# EAGLE design STM32F4CONSOLE (EAGLE 6.5.0)
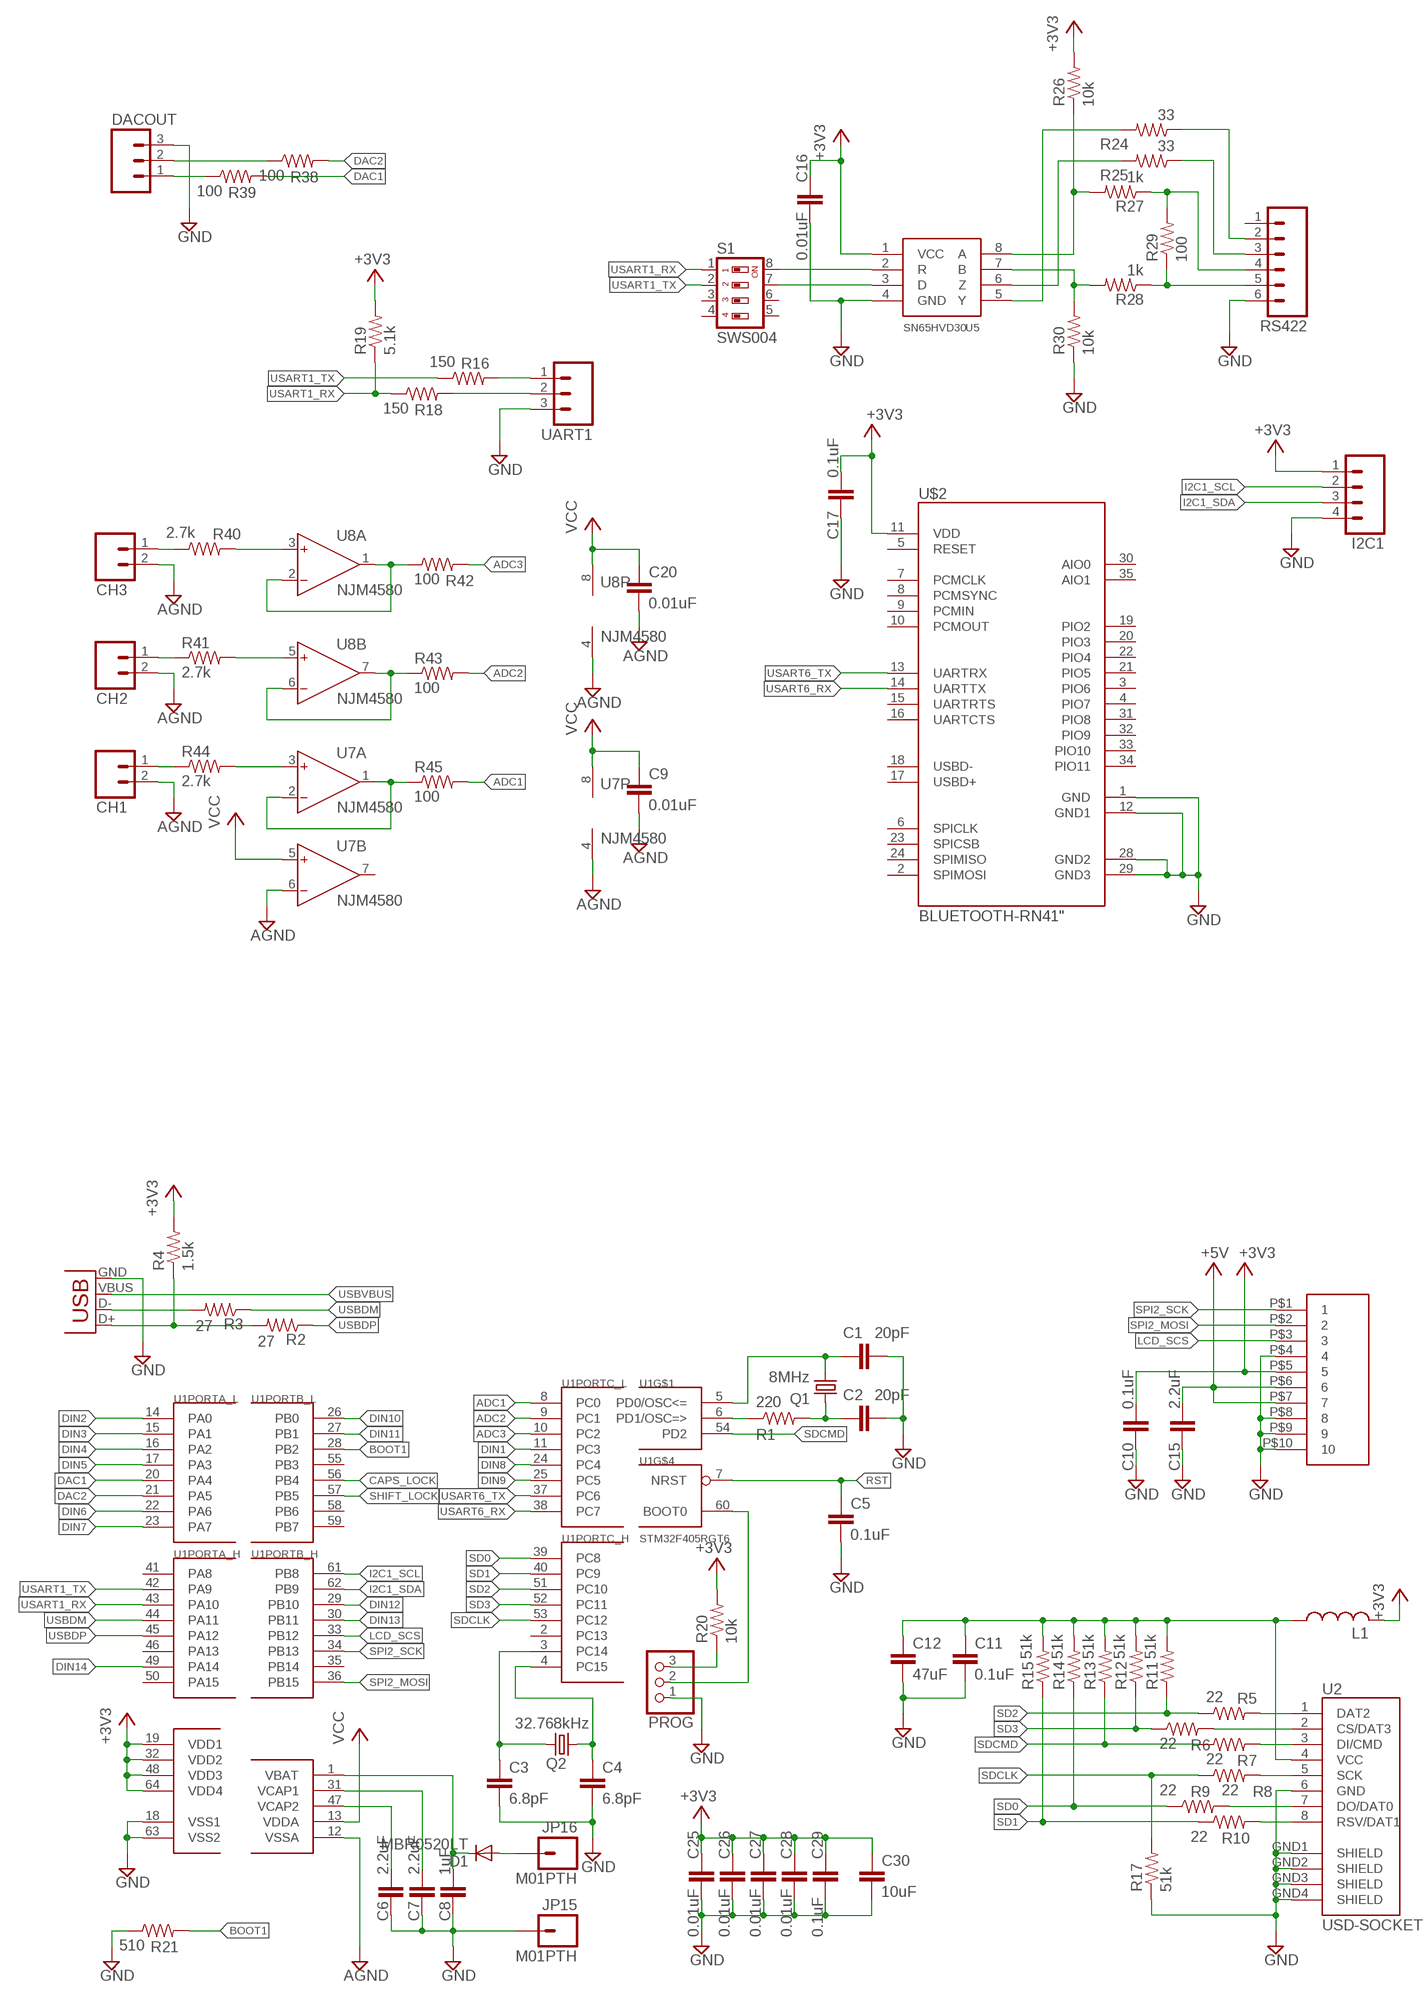
[diagram p0: schematic, sheet 1, part 1 of 2]
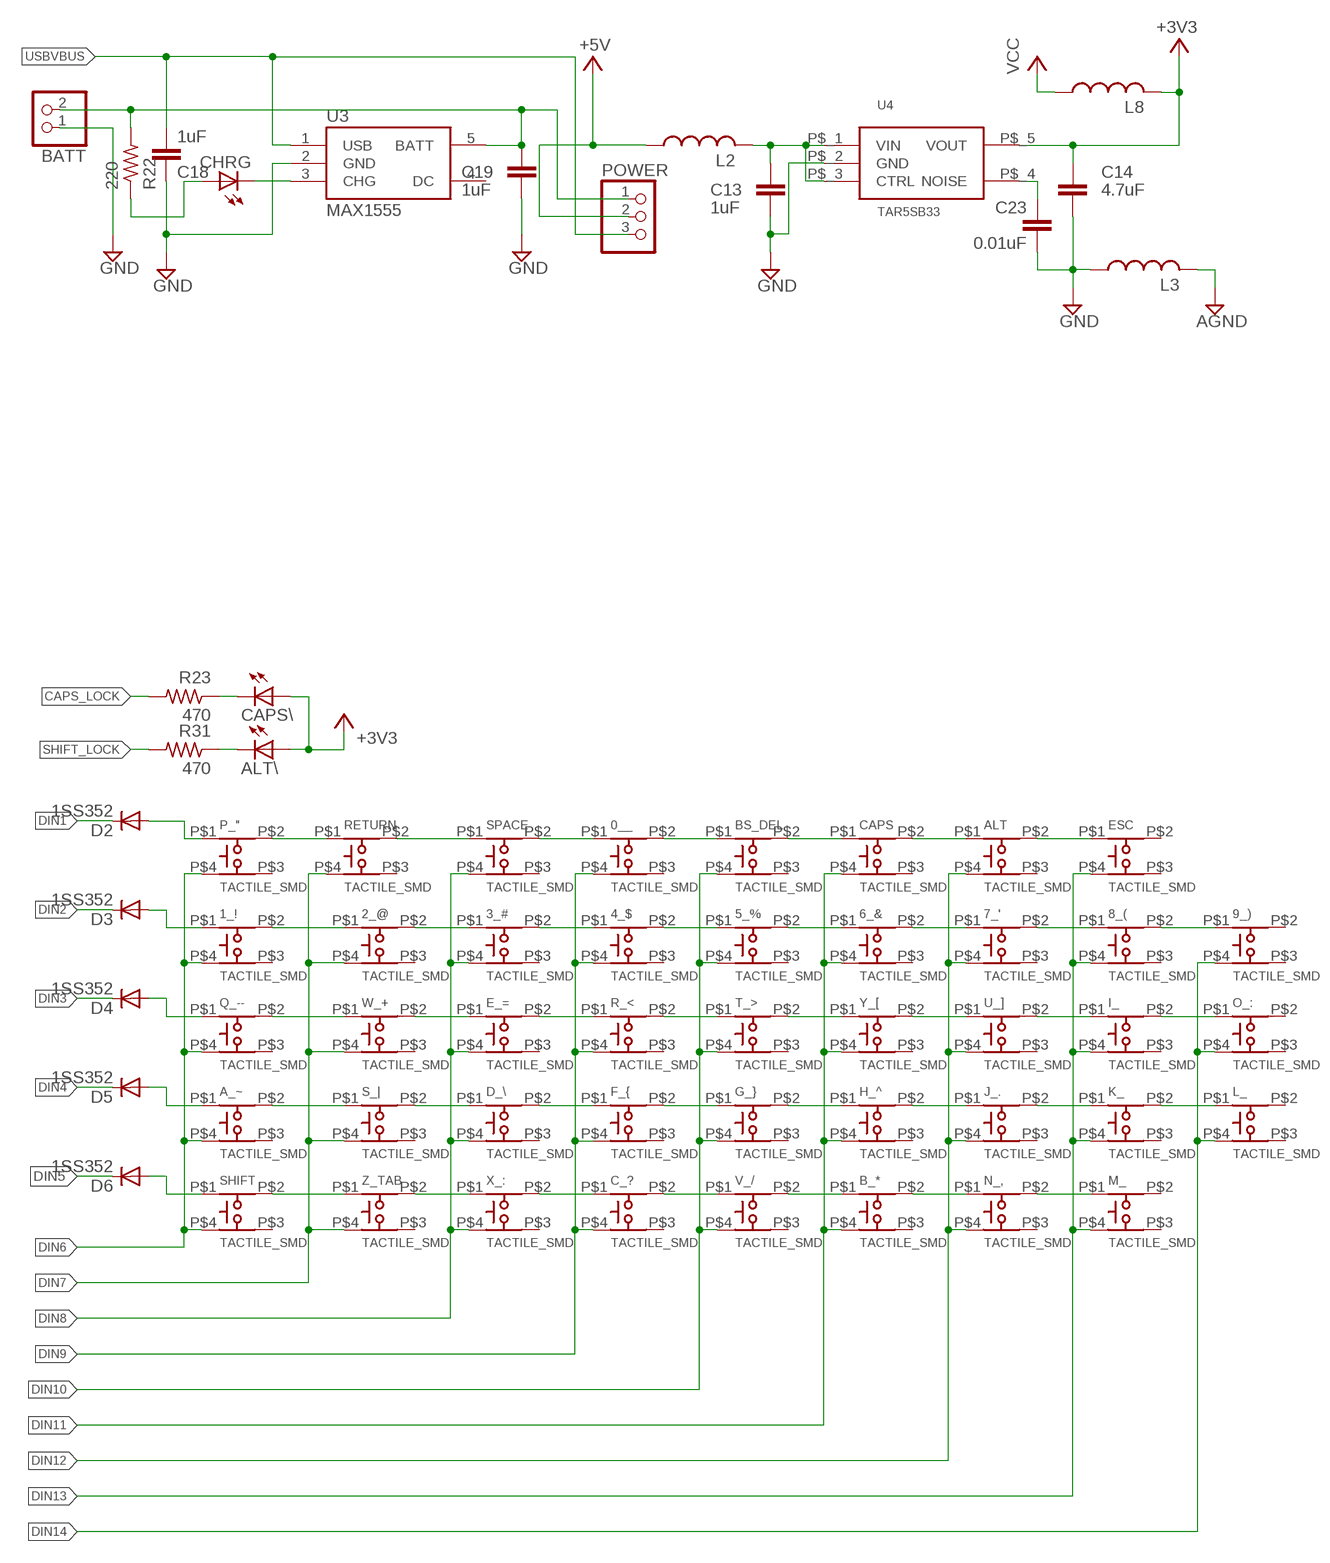
[diagram p1: schematic, sheet 1, part 2 of 2]

## Parts
0__  TACTILE_SMD  [TACTILE_SMD]
1_!  TACTILE_SMD  [TACTILE_SMD]
2_@  TACTILE_SMD  [TACTILE_SMD]
3_#  TACTILE_SMD  [TACTILE_SMD]
4_$  TACTILE_SMD  [TACTILE_SMD]
5_%  TACTILE_SMD  [TACTILE_SMD]
6_&  TACTILE_SMD  [TACTILE_SMD]
7_'  TACTILE_SMD  [TACTILE_SMD]
8_(  TACTILE_SMD  [TACTILE_SMD]
9_)  TACTILE_SMD  [TACTILE_SMD]
A_~  TACTILE_SMD  [TACTILE_SMD]
ALT  TACTILE_SMD  [TACTILE_SMD]
ALT\  LED0603  [LED-0603]
B_*  TACTILE_SMD  [TACTILE_SMD]
BATT  PINHD-1X2  [1X02]
BS_DEL  TACTILE_SMD  [TACTILE_SMD]
C1  20pF  C-EUC0603  [C0603]
C2  20pF  C-EUC0603  [C0603]
C3  6.8pF  C-EUC0603  [C0603]
C4  6.8pF  C-EUC0603  [C0603]
C5  0.1uF  C-EUC0603  [C0603]
C6  2.2uF  C-EUC0805  [C0805]
C7  2.2uF  C-EUC0805  [C0805]
C8  1uF  C-EUC1608  [C1608]
C9  0.01uF  C-EUC0603  [C0603]
C10  0.1uF  C-EUC0603  [C0603]
C11  0.1uF  C-EUC0603  [C0603]
C12  47uF  C-EUC3225  [C3225]
C13  1uF  C-EUC2012  [C2012]
C14  4.7uF  C-EUC2012  [C2012]
C15  2.2uF  C-EUC0805  [C0805]
C16  0.01uF  C-EUC0603  [C0603]
C17  0.1uF  C-EUC0603  [C0603]
C18  1uF  C-EUC2012  [C2012]
C19  1uF  C-EUC2012  [C2012]
C20  0.01uF  C-EUC0603  [C0603]
C23  0.01uF  C-EUC0603  [C0603]
C25  0.01uF  C-EUC0603  [C0603]
C26  0.01uF  C-EUC0603  [C0603]
C27  0.01uF  C-EUC0603  [C0603]
C28  0.01uF  C-EUC0603  [C0603]
C29  0.1uF  C-EUC0603  [C0603]
C30  10uF  C-EUC3216  [C3216]
C_?  TACTILE_SMD  [TACTILE_SMD]
CAPS  TACTILE_SMD  [TACTILE_SMD]
CAPS\  LED0603  [LED-0603]
CH1  M02PTH  [1X02]
CH2  M02PTH  [1X02]
CH3  M02PTH  [1X02]
CHRG  LED0603  [LED-0603]
D1  MBR0520LT  [SOD123]
D2  1SS352  DIODESOD  [SOD-323]
D3  1SS352  DIODESOD  [SOD-323]
D4  1SS352  DIODESOD  [SOD-323]
D5  1SS352  DIODESOD  [SOD-323]
D6  1SS352  DIODESOD  [SOD-323]
D_\\  TACTILE_SMD  [TACTILE_SMD]
DACOUT  M03PTH  [1X03]
E_=  TACTILE_SMD  [TACTILE_SMD]
ESC  TACTILE_SMD  [TACTILE_SMD]
F_{  TACTILE_SMD  [TACTILE_SMD]
G_}  TACTILE_SMD  [TACTILE_SMD]
H_^  TACTILE_SMD  [TACTILE_SMD]
I2C1  M04PTH  [1X04]
I_  TACTILE_SMD  [TACTILE_SMD]
J_.  TACTILE_SMD  [TACTILE_SMD]
JP15  M01PTH  [1X01]
JP16  M01PTH  [1X01]
K_  TACTILE_SMD  [TACTILE_SMD]
L1  L-USL3216C  [L3216C]
L2  L-USL3216C  [L3216C]
L3  L-USL3216C  [L3216C]
L8  L-USL3216C  [L3216C]
L_  TACTILE_SMD  [TACTILE_SMD]
M_  TACTILE_SMD  [TACTILE_SMD]
N_,  TACTILE_SMD  [TACTILE_SMD]
O_:  TACTILE_SMD  [TACTILE_SMD]
P_"  TACTILE_SMD  [TACTILE_SMD]
POWER  PINHD-1X3  [1X03]
PROG  PINHD-1X3  [1X03]
Q1  8MHz  CRYSTALHC49S  [HC49/S]
Q2  32.768kHz  CRYSTALTC26H  [TC26H]
Q_--  TACTILE_SMD  [TACTILE_SMD]
R1  220  R-US_R0603  [R0603]
R2  27  R-US_R0603  [R0603]
R3  27  R-US_R0603  [R0603]
R4  1.5k  R-US_R0603  [R0603]
R5  22  R-US_R0603  [R0603]
R6  22  R-US_R0603  [R0603]
R7  22  R-US_R0603  [R0603]
R8  22  R-US_R0603  [R0603]
R9  22  R-US_R0603  [R0603]
R10  22  R-US_R0603  [R0603]
R11  51k  R-US_R0603  [R0603]
R12  51k  R-US_R0603  [R0603]
R13  51k  R-US_R0603  [R0603]
R14  51k  R-US_R0603  [R0603]
R15  51k  R-US_R0603  [R0603]
R16  150  R-US_R0603  [R0603]
R17  51k  R-US_R0603  [R0603]
R18  150  R-US_R0603  [R0603]
R19  5.1k  R-US_R0603  [R0603]
R20  10k  R-US_R0603  [R0603]
R21  510  R-US_R0603  [R0603]
R22  220  R-US_R0603  [R0603]
R23  470  R-US_R0603  [R0603]
R24  33  R-US_R0603  [R0603]
R25  33  R-US_R0603  [R0603]
R26  10k  R-US_R0603  [R0603]
R27  1k  R-US_R0603  [R0603]
R28  1k  R-US_R0603  [R0603]
R29  100  R-US_R0603  [R0603]
R30  10k  R-US_R0603  [R0603]
R31  470  R-US_R0603  [R0603]
R38  100  R-US_R0603  [R0603]
R39  100  R-US_R0603  [R0603]
R40  2.7k  R-US_R0805  [R0805]
R41  2.7k  R-US_R0805  [R0805]
R42  100  R-US_R0603  [R0603]
R43  100  R-US_R0603  [R0603]
R44  2.7k  R-US_R0805  [R0805]
R45  100  R-US_R0603  [R0603]
R_<  TACTILE_SMD  [TACTILE_SMD]
RETURN  TACTILE_SMD  [TACTILE_SMD]
RS422  M06SIP  [1X06]
S1  SWS004  [SMSS-004]
S_|  TACTILE_SMD  [TACTILE_SMD]
SHIFT  TACTILE_SMD  [TACTILE_SMD]
SPACE  TACTILE_SMD  [TACTILE_SMD]
T_>  TACTILE_SMD  [TACTILE_SMD]
U1  STM32F405RGT6  [TQFP64]
U2  USD-SOCKET  [MICRO-SD-SOCKET-PP]
U3  MAX1555  [SOT23-5]
U4  TAR5SB33  [TAR5SB33]
U5  SN65HVD30  [SO8]
U6  FH12-10S-05  [FH12-10S-0.5SH]
U7  NJM4580  MAX4477AUR  [SO08]
U8  NJM4580  MAX4477AUR  [SO08]
U$2  BLUETOOTH-RN41"  [RN41]
U_]  TACTILE_SMD  [TACTILE_SMD]
UART1  M03PTH  [1X03]
V_/  TACTILE_SMD  [TACTILE_SMD]
W_+  TACTILE_SMD  [TACTILE_SMD]
X1  USBOLD  [USB-MINIB-OLD]
X_:  TACTILE_SMD  [TACTILE_SMD]
Y_[  TACTILE_SMD  [TACTILE_SMD]
Z_TAB  TACTILE_SMD  [TACTILE_SMD]

## Nets
+3V3: ALT\.A C10.1 C14.1 C16.1 C17.1 C25.1 C26.1 C27.1 C28.1 C29.1 C30.1 CAPS\.A I2C1.1 L1.2 L8.2 R4.2 R19.2 R20.2 R26.2 U1.19(VDD1) U1.32(VDD2) U1.48(VDD3) U1.64(VDD4) U4.P$_5(VOUT) U5.1(VCC) U6.P$5 U$2.11(VDD)
+5V: C15.1 L2.1 POWER.2 U6.P$6 U6.P$7
ADC1: R45.2 U1.8(PORTC_L:PC0)
ADC2: R43.2 U1.9(PORTC_L:PC1)
ADC3: R42.2 U1.10(PORTC_L:PC2)
AGND: C9.2 C20.2 CH1.2 CH2.2 CH3.2 L3.2 U1.12(VSSA) U7.4(P:V-) U7.6(B:IN-) U8.4(P:V-)
BOOT1: R21.2 U1.28(PORTB_L:PB2)
CAPS_LOCK: R23.2 U1.56(PORTB_L:PB4)
DAC1: R39.2 U1.20(PORTA_L:PA4)
DAC2: R38.2 U1.21(PORTA_L:PA5)
DIN1: D2.1(C) U1.11(PORTC_L:PC3)
DIN2: D3.1(C) U1.14(PORTA_L:PA0)
DIN3: D4.1(C) U1.15(PORTA_L:PA1)
DIN4: D5.1(C) U1.16(PORTA_L:PA2)
DIN5: D6.1(C) U1.17(PORTA_L:PA3)
DIN6: 1_!.P$4 A_~.P$4 P_".P$4 Q_--.P$4 SHIFT.P$4 U1.22(PORTA_L:PA6)
DIN7: 2_@.P$4 RETURN.P$4 S_|.P$4 U1.23(PORTA_L:PA7) W_+.P$4 Z_TAB.P$4
DIN8: 3_#.P$4 D_\\.P$4 E_=.P$4 SPACE.P$4 U1.24(PORTC_L:PC4) X_:.P$4
DIN9: 0__.P$4 4_$.P$4 C_?.P$4 F_{.P$4 R_<.P$4 U1.25(PORTC_L:PC5)
DIN10: 5_%.P$4 BS_DEL.P$4 G_}.P$4 T_>.P$4 U1.26(PORTB_L:PB0) V_/.P$4
DIN11: 6_&.P$4 B_*.P$4 CAPS.P$4 H_^.P$4 U1.27(PORTB_L:PB1) Y_[.P$4
DIN12: 7_'.P$4 ALT.P$4 J_..P$4 N_,.P$4 U1.29(PORTB_H:PB10) U_].P$4
DIN13: 8_(.P$4 ESC.P$4 I_.P$4 K_.P$4 M_.P$4 U1.30(PORTB_H:PB11)
DIN14: 9_).P$4 L_.P$4 O_:.P$4 U1.49(PORTA_H:PA14)
DIN_2: 6_&.P$2 7_'.P$1
DIN_3: I_.P$2 O_:.P$1
DIN_4: J_..P$2 K_.P$1
DIN_5: B_*.P$2 N_,.P$1
GND: BATT.1 C1.2 C2.2 C3.2 C4.2 C5.2 C6.2 C7.2 C8.2 C10.2 C11.2 C12.2 C13.2 C14.2 C15.2 C16.2 C17.2 C18.2 C19.2 C23.2 C25.2 C26.2 C27.2 C28.2 C29.2 C30.2 DACOUT.3 I2C1.4 JP15.1 L3.1 PROG.1 R17.1 R21.1 R30.1 RS422.6 U1.18(VSS1) U1.63(VSS2) U2.6(GND) U2.GND1(SHIELD) U2.GND2(SHIELD) U2.GND3(SHIELD) U2.GND4(SHIELD) U3.2(GND) U4.P$_2(GND) U5.4(GND) U6.P$4 U6.P$8 U6.P$9 U6.P$10 U$2.1(GND) U$2.12(GND1) U$2.28(GND2) U$2.29(GND3) UART1.3 X1.GND
I2C1_SCL: I2C1.2 U1.61(PORTB_H:PB8)
I2C1_SDA: I2C1.3 U1.62(PORTB_H:PB9)
LCD_SCS: U1.33(PORTB_H:PB12) U6.P$3
N$1: R1.1 U1.6(PD1/OSC=>)
N$2: C2.1 Q1.1 R1.2
N$3: C1.1 Q1.2 U1.5(PD0/OSC<=)
N$4: C6.1 U1.47(VCAP2)
N$5: C7.1 U1.31(VCAP1)
N$6: C4.1 Q2.2 U1.4(PORTC_H:PC15)
N$7: C3.1 Q2.1 U1.3(PORTC_H:PC14)
N$8: C8.1 D1.C U1.1(VBAT)
N$9: R5.2 U2.1(DAT2)
N$10: R6.2 U2.2(CS/DAT3)
N$11: R7.2 U2.3(DI/CMD)
N$12: D1.A JP16.1
N$13: R8.2 U2.5(SCK)
N$14: R9.2 U2.7(DO/DAT0)
N$15: R10.2 U2.8(RSV/DAT1)
N$16: BATT.2 C19.1 POWER.1 R22.2 U3.5(BATT)
N$17: R3.2 X1.D-
N$18: R2.2 R4.1 X1.D+
N$19: R18.2 UART1.2
N$20: R16.2 UART1.1
N$21: PROG.2 U1.60(BOOT0)
N$22: C13.1 L2.2 U4.P$_1(VIN) U4.P$_3(CTRL)
N$23: CHRG.A R22.1
N$24: CHRG.C U3.3(CHG)
N$25: D2.2(A) P_".P$1
N$26: P_".P$2 RETURN.P$1
N$27: RETURN.P$2 SPACE.P$1
N$28: 0__.P$1 SPACE.P$2
N$29: C11.1 C12.1 L1.1 R11.2 R12.2 R13.2 R14.2 R15.2 U2.4(VCC)
N$30: 0__.P$2 BS_DEL.P$1
N$31: 1_!.P$1 D3.2(A)
N$32: 1_!.P$2 2_@.P$1
N$33: D6.2(A) SHIFT.P$1
N$34: SHIFT.P$2 Z_TAB.P$1
N$35: C23.1 U4.P$_4(NOISE)
N$36: X_:.P$1 Z_TAB.P$2
N$37: C_?.P$1 X_:.P$2
N$38: C_?.P$2 V_/.P$1
N$39: A_~.P$2 S_|.P$1
N$40: F_{.P$2 G_}.P$1
N$41: CH3.1 R40.1
N$42: DACOUT.1 R39.1
N$43: DACOUT.2 R38.1
N$44: R40.2 U8.3(A:IN+)
N$45: CH2.1 R41.1
N$46: R41.2 U8.5(B:IN+)
N$47: R43.1 U8.6(B:IN-) U8.7(B:OUT)
N$48: R42.1 U8.1(A:OUT) U8.2(A:IN-)
N$49: CH1.1 R44.1
N$50: R44.2 U7.3(A:IN+)
N$51: R45.1 U7.1(A:OUT) U7.2(A:IN-)
N$52: PROG.3 R20.1
N$53: D_\\.P$2 F_{.P$1
N$54: D_\\.P$1 S_|.P$2
N$55: A_~.P$1 D5.2(A)
N$56: D4.2(A) Q_--.P$1
N$57: Q_--.P$2 W_+.P$1
N$58: E_=.P$1 W_+.P$2
N$59: E_=.P$2 R_<.P$1
N$60: R_<.P$2 T_>.P$1
N$61: 2_@.P$2 3_#.P$1
N$62: 3_#.P$2 4_$.P$1
N$63: 4_$.P$2 5_%.P$1
N$64: BS_DEL.P$2 CAPS.P$1
N$65: ALT.P$1 CAPS.P$2
N$66: ALT.P$2 ESC.P$1
N$67: S1.7 U5.3(D)
N$68: S1.8 U5.2(R)
N$69: R24.2 U5.5(Y)
N$70: 8_(.P$2 9_).P$1
N$71: 7_'.P$2 8_(.P$1
N$72: 5_%.P$2 6_&.P$1
N$73: T_>.P$2 Y_[.P$1
N$74: U_].P$1 Y_[.P$2
N$75: I_.P$1 U_].P$2
N$76: K_.P$2 L_.P$1
N$77: R25.2 U5.6(Z)
N$78: M_.P$1 N_,.P$2
N$79: B_*.P$1 V_/.P$2
N$80: G_}.P$2 H_^.P$1
N$81: H_^.P$2 J_..P$1
N$82: R28.2 R30.2 U5.7(B)
N$83: R26.1 R27.2 U5.8(A)
N$84: R28.1 R29.1 RS422.5
N$85: R27.1 R29.2 RS422.4
N$86: R25.1 RS422.3
N$87: R24.1 RS422.2
N$88: CAPS\.C R23.1
N$89: ALT\.C R31.1
RST: C5.1 U1.7(NRST)
SD0: R9.1 R14.1 U1.39(PORTC_H:PC8)
SD1: R10.1 R15.1 U1.40(PORTC_H:PC9)
SD2: R5.1 R11.1 U1.51(PORTC_H:PC10)
SD3: R6.1 R12.1 U1.52(PORTC_H:PC11)
SDCLK: R8.1 R17.2 U1.53(PORTC_H:PC12)
SDCMD: R7.1 R13.1 U1.54(PD2)
SHIFT_LOCK: R31.2 U1.57(PORTB_L:PB5)
SPI2_MOSI: U1.36(PORTB_H:PB15) U6.P$2
SPI2_SCK: U1.34(PORTB_H:PB13) U6.P$1
USART1_RX: R18.1 R19.1 S1.1 U1.43(PORTA_H:PA10)
USART1_TX: R16.1 S1.2 U1.42(PORTA_H:PA9)
USART6_RX: U1.38(PORTC_L:PC7) U$2.14(UARTTX)
USART6_TX: U1.37(PORTC_L:PC6) U$2.13(UARTRX)
USBDM: R3.1 U1.44(PORTA_H:PA11)
USBDP: R2.1 U1.45(PORTA_H:PA12)
USBVBUS: C18.1 POWER.3 U3.1(USB) X1.VBUS
VCC: C9.1 C20.1 L8.1 U1.13(VDDA) U7.5(B:IN+) U7.8(P:V+) U8.8(P:V+)
Unconnected: 0__.P$3 1_!.P$3 2_@.P$3 3_#.P$3 4_$.P$3 5_%.P$3 6_&.P$3 7_'.P$3 8_(.P$3 9_).P$2 9_).P$3 A_~.P$3 ALT.P$3 B_*.P$3 BS_DEL.P$3 C_?.P$3 CAPS.P$3 D_\\.P$3 E_=.P$3 ESC.P$2 ESC.P$3 F_{.P$3 G_}.P$3 H_^.P$3 I_.P$3 J_..P$3 K_.P$3 L_.P$2 L_.P$3 M_.P$2 M_.P$3 N_,.P$3 O_:.P$2 O_:.P$3 P_".P$3 Q_--.P$3 R_<.P$3 RETURN.P$3 RS422.1 S1.3 S1.4 S1.5 S1.6 S_|.P$3 SHIFT.P$3 SPACE.P$3 T_>.P$3 U1.2(PORTC_H:PC13) U1.35(PORTB_H:PB14) U1.41(PORTA_H:PA8) U1.46(PORTA_H:PA13) U1.50(PORTA_H:PA15) U1.55(PORTB_L:PB3) U1.58(PORTB_L:PB6) U1.59(PORTB_L:PB7) U3.4(DC) U7.7(B:OUT) U$2.2(SPIMOSI) U$2.3(PIO6) U$2.4(PIO7) U$2.5(RESET) U$2.6(SPICLK) U$2.7(PCMCLK) U$2.8(PCMSYNC) U$2.9(PCMIN) U$2.10(PCMOUT) U$2.15(UARTRTS) U$2.16(UARTCTS) U$2.17(USBD+) U$2.18(USBD-) U$2.19(PIO2) U$2.20(PIO3) U$2.21(PIO5) U$2.22(PIO4) U$2.23(SPICSB) U$2.24(SPIMISO) U$2.30(AIO0) U$2.31(PIO8) U$2.32(PIO9) U$2.33(PIO10) U$2.34(PIO11) U$2.35(AIO1) U_].P$3 V_/.P$3 W_+.P$3 X_:.P$3 Y_[.P$3 Z_TAB.P$3

## Library data of the parts
0__ 1_! 2_@ 3_# 4_$ 5_% 6_& 7_' 8_( 9_) A_~ ALT B_* BS_DEL C_? CAPS D_\\ E_= ESC F_{ G_} H_^ I_ J_. K_ L_ M_ N_, O_: P_" Q_-- R_< RETURN S_| SHIFT SPACE T_> U_] V_/ W_+ X_: Y_[ Z_TAB = mizdevice:TACTILE_SMD: TACTILE Push SW ALPS SKRPACE010
ALT\ CAPS\ CHRG = SparkFun:LED: LEDs Standard schematic elements and footprints for 5mm, 3mm, 1206, and 0603 sized LEDs. 5mm - Spark Fun Electronics SKU : COM-00529 (and others)
BATT = mizdevice:PINHD-1X2: PIN HEADER
C1-C20 C23 C25-C30 = rcl:C-EU: CAPACITOR, European symbol
CH1-CH3 = SparkFun:M02: Header 2 Standard 2-pin 0.1" header. Use with straight break away headers (SKU : PRT-00116), right angle break away headers (PRT-00553), swiss pins (PRT-00743), machine pins (PRT-00117), and female headers (PRT-00115). Molex polarized connector foot print use with SKU : PRT-08233 with associated crimp pins and housings.
D1 = diode:MBR0520LT: SCHOTTKY BARRIER RECTIFIER Source: http://onsemi.com .. MBR0520LT1-D.pdf
D2-D6 = SparkFun:DIODE: Diode These are standard reverse protection diodes and small signal diodes. SMA package can handle up to about 1A. SOD-323 can handle about 200mA. What the SOD-323 package when ordering, there are some mfgs out there that are 5-pin packages.
DACOUT UART1 = SparkFun:M03: Header 3 Standard 3-pin 0.1" header. Use with straight break away headers (SKU : PRT-00116), right angle break away headers (PRT-00553), swiss pins (PRT-00743), machine pins (PRT-00117), and female headers (PRT-00115). Molex polarized connector foot print use with SKU : PRT-08232 with associated crimp pins and housings.
I2C1 = SparkFun:M04: Header 4 Standard 4-pin 0.1" header. Use with straight break away headers (SKU : PRT-00116), right angle break away headers (PRT-00553), swiss pins (PRT-00743), machine pins (PRT-00117), and female headers (PRT-00115). Molex polarized connector foot print use with SKU : PRT-08231 with associated crimp pins and housings. 1MM SMD Version SKU: PRT-10208
JP15 JP16 = SparkFun:M01: Header 1 Standard 1-pin 0.1" header. Use with straight break away headers (SKU : PRT-00116), right angle break away headers (PRT-00553), swiss pins (PRT-00743), machine pins (PRT-00117), and female headers (PRT-00115).
L1-L3 L8 = rcl:L-US: INDUCTOR, American symbol
POWER PROG = mizdevice:PINHD-1X3: PIN HEADER
Q1 = crystal:CRYSTAL: CRYSTAL; OC_FARNELL: 1667008; OC_NEWARK: unknown
Q2 = crystal:CRYSTAL: CRYSTAL; OC_FARNELL: unknown; OC_NEWARK: unknown
R1-R31 R38-R45 = rcl:R-US_: RESISTOR, American symbol
RS422 = SparkFun:M06: Header 6 Standard 6-pin 0.1" header. Use with straight break away headers (SKU : PRT-00116), right angle break away headers (PRT-00553), swiss pins (PRT-00743), machine pins (PRT-00117), and female headers (PRT-00115). Molex polarized connector foot print use with SKU : PRT-08094 with associated crimp pins and housings. NOTES ON THE VARIANTS LOCK and LOCK_LONGPADS... This footprint was designed to help hold the alignment of a through-hole component (i.e. 6-pin header) while soldering it into place. You may notice that each hole has been shifted either up or down by 0.005 of an inch from it's more standard position (which is a perfectly straight line). This slight alteration caused the pins (the squares in the middle) to touch the edges of the holes. Because they are alternating, it causes a "brace" to hold the component in place. 0.005 has proven to be the perfect amount of "off-center" position when using our standard breakaway headers. Although looks a little odd when you look at the bare footprint, once you have a header in there, the alteration is very hard to notice. Also, if you push a header all the way into place, it is covered up entirely on the bottom side. This idea of altering the position of holes to aid alignment will be further integrated into the Sparkfun Library for other footprints. It can help hold any component with 3 or more connection pins.
S1 = mizdevice:SWS004: SMD Dip Switch 4 pol.
U1 = mizdevice:STM32F405RGT6: STM32F405 64pin LQFP
U2 = mizdevice:USD-SOCKET: Hirose microSD Socket DM3AT-SF-PEJ
U3 = SparkFun:MAX1555: MAX1555 Lithium Charger IC SOT-23 Lithium Polymer charging IC. Schematic element and footprint proven. Spark Fun Electronics SKU : COM-00674
U4 = mizdevice:TAR5SB33: Toshiba TAR5SB33 3.3V Lowdrop Reg
U5 = mizdevice:SN65HVD30
U6 = mizdevice:FH12-10S-05: HRS FPC Connector FH12-10S-05SH
U7 U8 = mizdevice:MAX4477AU: 8 MHz Rail-to-Rail Operational Amplifiers Source: http://www.analog.com/static/imported-files/data_sheets/AD8519_8529.pdf
U$2 = SparkFun-RF:BLUETOOTH-RN41: Bluetooth SMD module
X1 = SparkFun:USB: USB Connectors USB-B-PTH is fully proven SKU : PRT-00139 USB-miniB is fully proven SKU : PRT-00587 USB-A-PCB is untested. USB-A-H is throughly reviewed, but untested. Spark Fun Electronics SKU : PRT-00437 USB-B-SMT is throughly reviewed, but untested. Needs silkscreen touching up. USB-A-S has not been used/tested USB-MB-H has not been used/tested

## Board
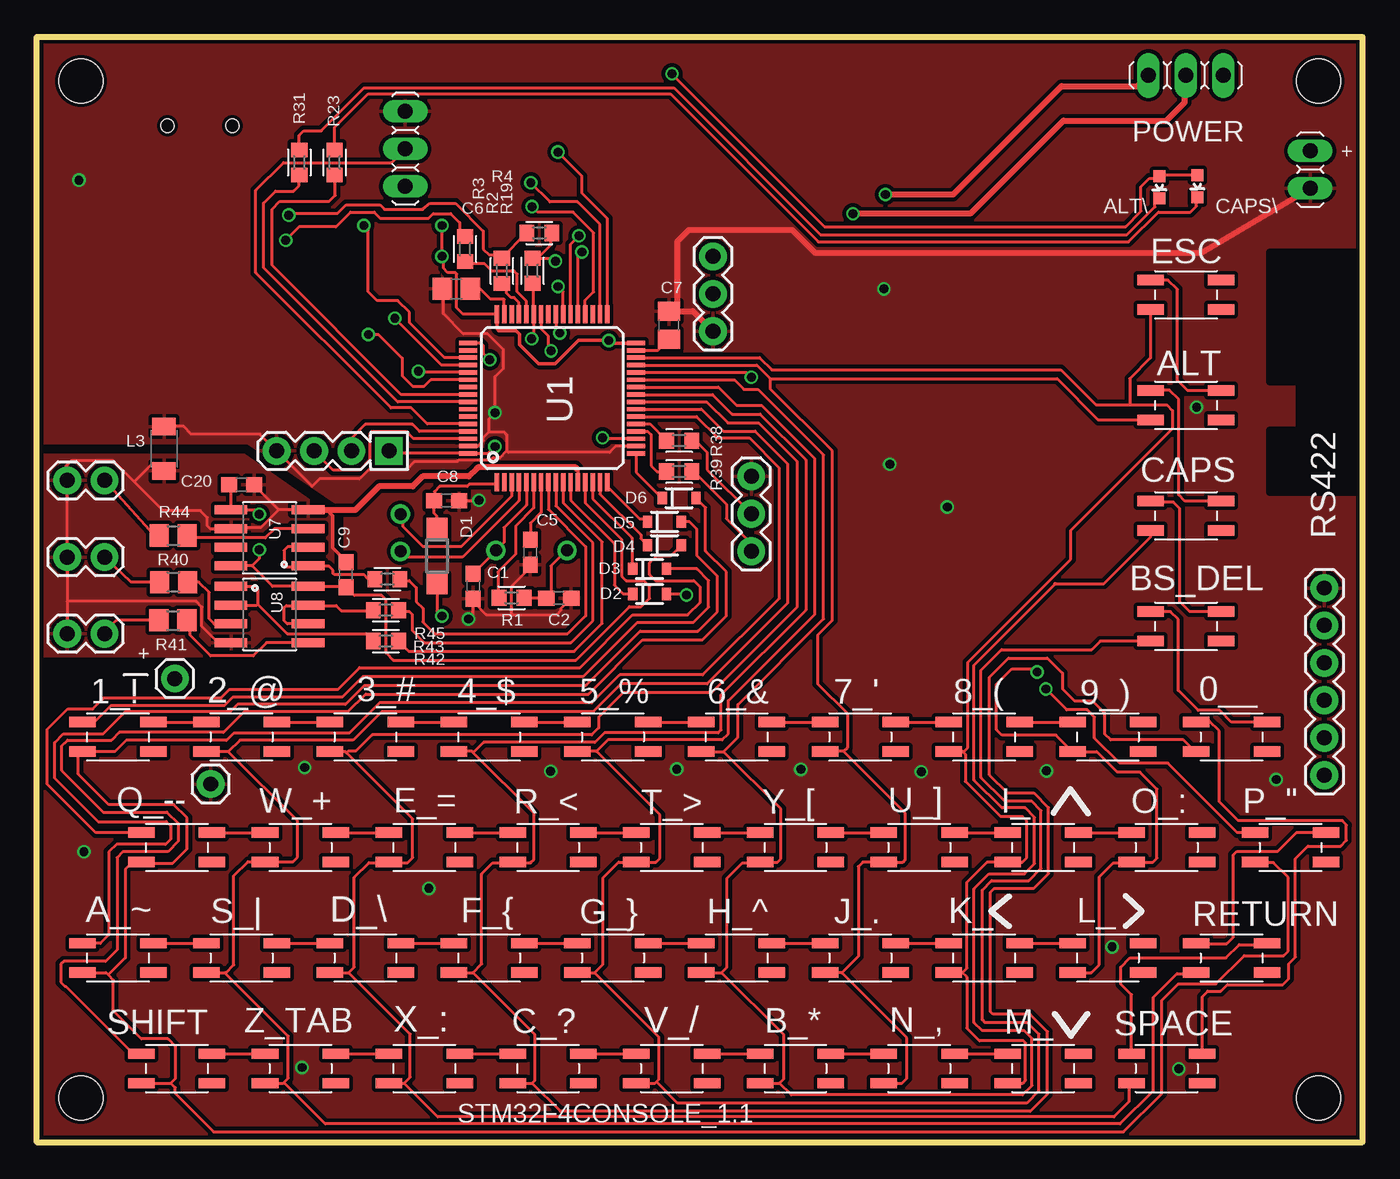
[diagram p2: board, top side]
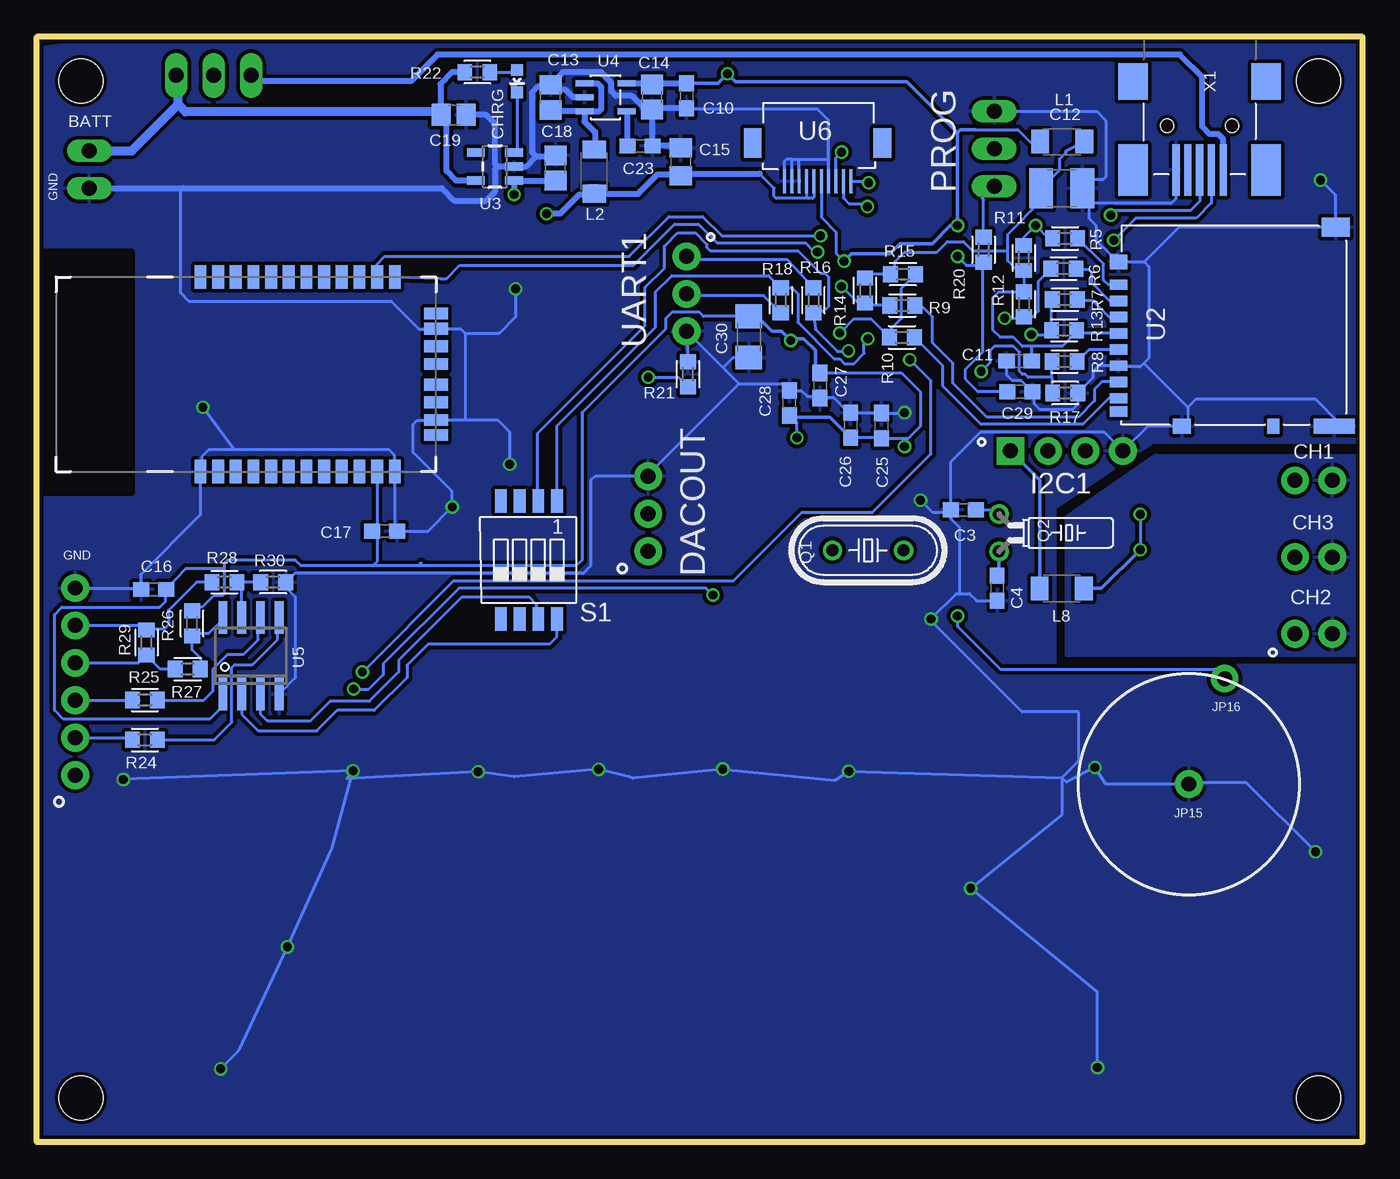
[diagram p3: board, bottom side, seen from below]

Size 90 x 75 mm. Coordinates in mm from the lower left corner, seen from the top.
Outline: 0,0 90,0 90,75 0,75 0,0
Copper layers (1*16): Top 0.035mm / dielectric 1.5mm / Bottom 0.035mm
Design rules "Elecrow_2-layer_eagle_rule": minimum track width 6mil, minimum drill 12mil, track to track 6mil, track to pad 6mil, pad to pad 6mil, via to via 6mil, smd to smd 0mil, copper to edge 10mil, drill to drill 10mil, minimum pad ring 10mil, minimum via ring 6mil, stop-mask expansion 2mil, vias tented up to drill 100mil, thermal gap 10mil
Holes 3 mm at 87,72 87,3 3,3 3,72
tRestrict: area 83.7,51.6 to 89.6,60.4; area 85.7,44.1 to 89.6,51.7; area 83.7,44.1 to 89.6,48.3
bRestrict: area 83.6,44.1 to 89.6,60.4

### Footprints (pad centres in the part's own frame; a part is rotated, then mirrored left to right if it is on the bottom)
TACTILE_SMD = smd 1.8 x 0.7: P$1 -2.4,1; P$2 2.4,1; P$3 2.4,-1; P$4 -2.4,-1
LED-0603 = smd 0.8 x 0.8: A 0,-0.75; C 0,0.75
1X02 = drill 1.016 long: 1 -1.27,0; 2 1.27,0
C0603 = smd 1.1 x 1: 1 -0.85,0; 2 0.85,0
C0805 = smd 1.3 x 1.5: 1 -0.95,0; 2 0.95,0
C1608 = smd 1.1 x 1: 1 -0.85,0; 2 0.85,0
C3225 = smd 1.6 x 2.7: 1 -1.4,0; 2 1.4,0
C2012 = smd 1.3 x 1.5: 1 -0.85,0; 2 0.85,0
C3216 = smd 1.6 x 1.8: 1 -1.4,0; 2 1.4,0
1X02' = drill 1.016 pad 1.88: 1 0,0; 2 2.54,0
SOD123 = smd 1.4 x 1.4: A 1.9,0; C -1.9,0
SOD-323 = smd 0.63 x 0.83: 1 -1.15,0; 2 1.15,0
1X03 = drill 1.016 pad 1.88: 1 0,0; 2 2.54,0; 3 5.08,0
1X04 = drill 1.016 pad 1.88 square: 1 0,0 | drill 1.016 pad 1.88: 2 2.54,0; 3 5.08,0; 4 7.62,0
1X01 = drill 1.016 pad 1.88: 1 0,0
L3216C = smd 1.2 x 1.6: 1 -1.5,0; 2 1.5,0
1X03' = drill 1.016 long: 1 -2.54,0; 2 0,0; 3 2.54,0
HC49/S = drill 0.813: 1 -2.413,0; 2 2.413,0
TC26H = drill 0.813: 1 -1.27,0; 2 1.27,0
R0603 = smd 1 x 1.1: 1 -0.85,0; 2 0.85,0
R0805 = smd 1.3 x 1.5: 1 -0.95,0; 2 0.95,0
1X06 = drill 1.016 pad 1.88: 1 0,0; 2 2.54,0; 3 5.08,0; 4 7.62,0; 5 10.16,0; 6 12.7,0
SMSS-004 = smd 0.8 x 1.6: 1 -1.905,-3.996; 2 -0.635,-3.996; 3 0.635,-3.996; 4 1.905,-3.996; 5 1.905,3.996; 6 0.635,3.996; 7 -0.635,3.996; 8 -1.905,3.996
TQFP64 = smd 1.2 x 0.3: 1 -5.7,3.75; 2 -5.7,3.25; 3 -5.7,2.75; 4 -5.7,2.25; 5 -5.7,1.75; 6 -5.7,1.25; 7 -5.7,0.75; 8 -5.7,0.25; 9 -5.7,-0.25; 10 -5.7,-0.75; 11 -5.7,-1.25; 12 -5.7,-1.75; 13 -5.7,-2.25; 14 -5.7,-2.75; 15 -5.7,-3.25; 16 -5.7,-3.75; 33 5.7,-3.75; 34 5.7,-3.25; 35 5.7,-2.75; 36 5.7,-2.25; 37 5.7,-1.75; 38 5.7,-1.25; 39 5.7,-0.75; 40 5.7,-0.25; 41 5.7,0.25; 42 5.7,0.75; 43 5.7,1.25; 44 5.7,1.75; 45 5.7,2.25; 46 5.7,2.75; 47 5.7,3.25; 48 5.7,3.75 | smd 0.3 x 1.2: 17 -3.75,-5.7; 18 -3.25,-5.7; 19 -2.75,-5.7; 20 -2.25,-5.7; 21 -1.75,-5.7; 22 -1.25,-5.7; 23 -0.75,-5.7; 24 -0.25,-5.7; 25 0.25,-5.7; 26 0.75,-5.7; 27 1.25,-5.7; 28 1.75,-5.7; 29 2.25,-5.7; 30 2.75,-5.7; 31 3.25,-5.7; 32 3.75,-5.7; 49 3.75,5.7; 50 3.25,5.7; 51 2.75,5.7; 52 2.25,5.7; 53 1.75,5.7; 54 1.25,5.7; 55 0.75,5.7; 56 0.25,5.7; 57 -0.25,5.7; 58 -0.75,5.7; 59 -1.25,5.7; 60 -1.75,5.7; 61 -2.25,5.7; 62 -2.75,5.7; 63 -3.25,5.7; 64 -3.75,5.7
MICRO-SD-SOCKET-PP = smd 0.7 x 1.2: 1 0,15.7; 2 -1.1,15.7; 3 -2.2,15.7; 4 -3.3,15.7; 5 -4.4,15.7; 6 -5.5,15.7; 7 -6.6,15.7; 8 -7.7,15.7; CD1 -8.6,15.7 | smd 1 x 0.8: CD2 -9.6,5.2 | smd 1 x 1.2: GND1 -9.6,11.4; GND4 1.55,15.7 | smd 1 x 2.8: GND2 -9.6,1.05 | smd 1.3 x 1.9: GND3 3.9,0.95
SOT23-5 = smd 0.55 x 1.2: 1 -0.95,-1.3; 2 0,-1.3; 3 0.95,-1.3; 4 0.95,1.3; 5 -0.95,1.3
TAR5SB33 = smd 1.2 x 0.4: P$_1 -1.425,0.95; P$_2 -1.425,0; P$_3 -1.425,-0.95; P$_4 1.425,-0.95; P$_5 1.425,0.95
SO8 = smd 0.6 x 2.2: 1 -1.905,-2.6; 2 -0.635,-2.6; 3 0.635,-2.6; 4 1.905,-2.6; 5 1.905,2.6; 6 0.635,2.6; 7 -0.635,2.6; 8 -1.905,2.6
FH12-10S-0.5SH = smd 0.2 x 1.6: P$1 -2.25,0.8; P$2 -1.75,0.8; P$3 -1.25,0.8; P$4 -0.75,0.8; P$5 -0.25,0.8; P$6 0.25,0.8; P$7 0.75,0.8; P$8 1.25,0.8; P$9 1.75,0.8; P$10 2.25,0.8 | smd 1.2 x 2: P$11 -4.4,-1.8; P$12 4.4,-1.8
SO08 = smd 0.61 x 2.21: 1 -1.905,-2.616; 2 -0.635,-2.616; 3 0.635,-2.616; 4 1.905,-2.616; 5 1.905,2.616; 6 0.635,2.616; 7 -0.635,2.616; 8 -1.905,2.616
RN41 = smd 0.8 x 1.6: 1 -6.6,-6.6; 2 -5.4,-6.6; 3 -4.2,-6.6; 4 -3,-6.6; 5 -1.8,-6.6; 6 -0.6,-6.6; 7 0.6,-6.6; 8 1.8,-6.6; 9 3,-6.6; 10 4.2,-6.6; 11 5.4,-6.6; 12 6.6,-6.6; 13 6.6,6.6; 14 5.4,6.6; 15 4.2,6.6; 16 3,6.6; 17 1.8,6.6; 18 0.6,6.6; 19 -0.6,6.6; 20 -1.8,6.6; 21 -3,6.6; 22 -4.2,6.6; 23 -5.4,6.6; 24 -6.6,6.6 | smd 1.6 x 0.8: 28 9.4,3.1; 29 9.4,-3.1; 30 9.4,4.122; 31 9.4,1.9; 32 9.4,0.7; 33 9.4,-0.7; 34 9.4,-1.9; 35 9.4,-4.122
USB-MINIB-OLD = smd 2.5 x 2: 1 -3,-4.5; 2 -3,4.5 | smd 3.5 x 2: 3 3,-4.5; 4 3,4.5 | smd 3.5 x 0.5: D+ 3,0; D- 3,0.8; GND 3,-1.6; ID 3,-0.8; VBUS 3.01,1.61 | hole 0.9: 0,2.2; 0,-2.2

### Placement (x,y rotation side)
0__  81.1,27.5 0 top
1_!  5.5,27.5 0 top
2_@  13.9,27.5 0 top
3_#  22.3,27.5 0 top
4_$  30.7,27.5 0 top
5_%  39.1,27.5 0 top
6_&  47.5,27.5 0 top
7_'  55.9,27.5 0 top
8_(  64.3,27.5 0 top
9_)  72.7,27.5 0 top
A_~  5.5,12.5 0 top
ALT  78,50 0 top
ALT\  76.2,64.79 180 top
B_*  51.5,5 0 top
BATT  86.44,66 90 top
BS_DEL  78,35 0 top
C1  29.61,37.72 270 top
C2  35.43,36.91 0 top
C3  27.1,42.91 180 bottom
C4  24.81,37.59 270 bottom
C5  33.49,40.02 270 top
C6  28.48,57.9 180 top
C7  42.9,55.43 90 top
C8  27.81,43.52 0 top
C9  21,38.5 90 top
C10  45.9,71 270 bottom
C11  23.32,53.01 180 bottom
C12  20.43,64.73 0 bottom
C13  55.14,70.89 90 bottom
C14  48.24,70.92 270 bottom
C15  46.29,66.52 90 bottom
C16  82.06,37.5 180 bottom
C17  66.39,41.45 0 bottom
C18  54.8,66.1 90 bottom
C19  61.7,69.7 0 bottom
C20  13.9,44.6 0 top
C23  49.06,67.6 0 bottom
C25  32.66,48.62 90 bottom
C26  34.76,48.64 90 bottom
C27  36.84,51.34 270 bottom
C28  38.91,50.15 90 bottom
C29  23.27,50.91 0 bottom
C30  41.66,54.64 270 bottom
C_?  34.7,5 0 top
CAPS  78,42.5 0 top
CAPS\  78.78,64.86 180 top
CH1  [1X02']  4.6,44.9 180 top
CH2  [1X02']  4.6,34.5 180 top
CH3  [1X02']  4.6,39.7 180 top
CHRG  57.4,72 180 bottom
D1  27.17,39.78 270 top
D2  41.6,37.2 0 top
D3  41.6,38.9 0 top
D4  42.6,40.5 0 top
D5  42.6,42.1 0 top
D6  43.6,43.7 0 top
D_\\  22.3,12.5 0 top
DACOUT  48.5,40.1 90 top
E_=  26.3,20 0 top
ESC  78,57.5 0 top
F_{  30.7,12.5 0 top
G_}  39.1,12.5 0 top
H_^  47.5,12.5 0 top
I2C1  23.9,46.9 180 top
I_  68.3,20 0 top
J_.  55.9,12.5 0 top
JP15  11.8,24.3 0 top
JP16  9.37,31.45 0 top
K_  64.3,12.5 0 top
L1  20.39,67.89 180 bottom
L2  52.17,65.85 90 bottom
L3  8.63,47.05 270 top
L8  20.42,37.57 180 bottom
L_  72.7,12.5 0 top
M_  68.3,5 0 top
N_,  59.9,5 0 top
O_:  76.7,20 0 top
P_"  85.1,20 0 top
POWER  [1X03']  78,72.39 180 top
PROG  [1X03']  25.01,67.4 270 top
Q1  33.58,40.16 0 bottom
Q2  24.69,41.35 270 bottom
Q_--  9.5,20 0 top
R1  32.23,36.93 0 top
R2  31.57,59.12 90 top
R3  29.07,60.61 90 top
R4  34.11,61.69 0 top
R5  20.2,61.33 0 bottom
R6  20.31,59.27 0 bottom
R7  20.22,57.17 0 bottom
R8  20.23,52.97 0 bottom
R9  31.24,56.77 0 bottom
R10  31.27,54.61 0 bottom
R11  23.01,59.99 270 bottom
R12  22.99,56.85 90 bottom
R13  20.27,55.09 0 bottom
R14  33.78,57.79 90 bottom
R15  31.21,58.89 180 bottom
R16  37.28,57.13 90 bottom
R17  20.19,50.83 180 bottom
R18  39.5,57.13 270 bottom
R19  33.65,59.13 90 top
R20  25.73,60.55 270 bottom
R21  45.8,52.1 270 bottom
R22  60.1,72.6 180 bottom
R23  20.21,66.47 270 top
R24  82.66,27.3 0 bottom
R25  82.66,30 0 bottom
R26  79.46,35.2 90 bottom
R27  79.76,32.1 0 bottom
R28  77.26,38 0 bottom
R29  82.56,33.9 270 bottom
R30  73.96,38 180 bottom
R31  17.82,66.47 270 top
R38  43.6,47.6 180 top
R39  43.6,45.5 180 top
R40  9.28,38 0 top
R41  9.24,35.4 0 top
R42  23.7,34 0 top
R43  23.7,36.1 0 top
R44  9.26,41.16 0 top
R45  23.8,38.2 0 top
R_<  34.7,20 0 top
RETURN  81.1,12.5 0 top
RS422  87.4,24.9 90 top
S1  56.6,39.5 180 bottom
S_|  13.9,12.5 0 top
SHIFT  9.5,5 0 top
SPACE  76.7,5 0 top
T_>  43.1,20 0 top
U1  34.98,50.48 90 top
U2  0.87,58.18 90 bottom
U3  58.9,66.2 90 bottom
U4  51.4,70.9 0 bottom
U5  75.46,33 0 bottom
U6  37,66 180 bottom
U7  15.8,41 90 top
U8  15.8,35.8 270 top
U$2  72.3,52.1 0 bottom
U_]  59.9,20 0 top
UART1  45.9,60.1 270 top
V_/  43.1,5 0 top
W_+  17.9,20 0 top
X1  11.07,68.97 270 bottom
X_:  26.3,5 0 top
Y_[  51.5,20 0 top
Z_TAB  17.9,5 0 top

### Tracks (layer width: path | path; a pad name or v marks a point on that pad's centre or on a via)
+3V3  (via drill 0.6)
  Top 0.2: R19.2 33.72,60.08 33.88,60.08 | U1.48 28.92,56.18 28.5,56.6 28.5,58.9 28.4,59 27.9,59 27.6,59.3 27.6,60 v27.5,60.1 v27.5,62.2 | I2C1.1 24.07,46.73 U1.64 30.63,46.73 v31.1,47.2 | 40.65,54.2 U1.32 | U1.19 38.47,47.73 v38.4,47.8 | 33.98,59.98 34.9,60.9 34.9,61.63 R4.2 | 33.67,60 R19.2 | CAPS\.A 76.27,65.61 ALT\.A 76.06,65.4 75.52,65.4 74.95,64.83 74.95,63.17 73.91,62.13 53.46,62.13 43.12,72.47 v43.12,72.5 | 33.98,59.98 35,59.98 v35.2,59.78 | 33.98,59.98 R19.2
  Top 0.254: 40.65,54.2 39.01,54.2 v38.82,54.39 38.8,54.41 36.76,54.41 35.18,52.83 34.06,52.83 32.78,54.11 32.78,54.82 32.54,55.06 31.35,55.06 31.23,55.18 U1.48
  Bottom 0.2: 39.01,49.2 C28.1 38.4,48.79 v38.4,47.8 | C26.1 32.68,47.79 C25.1 31,47.77 | 48.16,71.85 C14.1 | 31,47.77 30.83,47.77 30,48.6 30,50.88 31.31,52.19 C27.1 37.15,52.5 | v31.1,47.2 31.1,47.67 31,47.77 | 77.26,38.9 77.26,37.2 77.36,37.1 77.96,37.1 78.76,36.3 79.21,36.3 R26.2 | 77.26,38.9 79.91,38.9 C16.1 | 81.36,37.35 C16.1 | U5.1 77.36,29.59 78.26,28.7 88.2,28.7 88.8,29.3 88.8,35.8 88.3,36.3 81.66,36.3 81.26,36.7 81.26,37.45 C16.1 | 77.26,38.9 77.26,39.3 77.06,39.5 72.46,39.5 72.06,39.1 67.19,39.1 | C29.1 26.11,50.91 27,51.8 27,52.4 25.8,53.6 25.8,59.63 R20.2 | v27.5,60.1 26.9,59.5 25.93,59.5 R20.2 | 25.9,59.53 R20.2 | 26.3,68.7 23.41,68.7 22.55,67.84 21.94,67.84 L1.2 | 64.1,39.1 53.4,39.1 53,39.5 53,49.5 47.3,55.2 47.3,55.9 46.9,56.3 45.01,56.3 44.75,56.04 C30.1 41.33,56.04 | 64.1,39.1 67.19,39.1 | 63.9,39.3 64.1,39.1 | U6.P$5 36.75,62.76 35.74,61.75 35.74,60.32 v35.2,59.78 | U$2.11 66.9,41.79 | 66.9,41.79 C17.1 | 66.9,41.79 66.9,39.39 67.19,39.1
  Bottom 0.254: C26.1 35,47.8 | 39.01,49.2 36.17,49.2 C26.1 | 41.33,56.04 41.11,56.04 40.09,55.02 39.45,55.02 v38.82,54.39 38.69,54.52 37.95,54.52 37.15,53.72 37.15,52.5 | 27.5,68.49 v27.5,62.2 27.99,62.2 29.22,60.97 31.4,60.97 32.09,60.28 34.7,60.28 v35.2,59.78 | 27.5,68.49 30.95,71.94 42.56,71.94 v43.12,72.5 43.77,71.85 C10.1 | 26.3,68.7 27.29,68.7 27.5,68.49 | L8.2 21.92,44.92 I2C1.1
  Bottom 0.406: U4.P$_5 48.32,71.85 C14.1 | 48.16,71.85 C10.1
+5V  (via drill 0.6)
  Top 0.406: v55.4,63 63.37,63 69.69,69.32 76.68,69.32 77.92,70.56 77.92,72.31 POWER.2
  Bottom 0.2: 46.1,65.7 46.55,65.7 C15.1 46.65,65.5 | U6.P$6 37.25,64.11 37.32,64.04 37.64,64.04 | 37.64,64.04 39.81,64.04 39.96,64.19 39.96,64.74 40.94,65.72 | U6.P$7 37.75,64.15 37.64,64.04
  Bottom 0.406: 51.9,64.8 52.53,64.8 L2.1 | 46.1,65.7 40.94,65.72 | v55.4,63 54.47,63 53.16,64.31 52.21,64.31 L2.1 | L2.1 49.18,64.35 47.86,65.67 46.39,65.67 C15.1
ADC1
  Top 0.2: U1.8 34.73,42.93 37.25,40.41 37.25,35.71 36.04,34.5 27,34.5 26.2,35.3 26.21,35.31 26.21,36.22 25.76,36.67 25.76,37.62 25.28,38.1 24.75,38.1 R45.2
ADC2
  Top 0.2: U1.9 35.23,43.17 37.74,40.66 37.74,35.38 36.26,33.9 26.3,33.9 25.5,34.7 25.5,35.8 25.3,36 24.65,36 R43.2
ADC3
  Top 0.2: R42.2 25.25,33.3 36.47,33.3 38.37,35.2 38.37,40.73 35.73,43.37 U1.10
AGND
  Top 0.2: 16.41,42.91 U7.4 18.52,42.8 | 16.41,42.91 15.2,41.7 13.25,41.7 U7.6 13.15,41.6 11.8,41.6 11.58,41.82 11.58,42.37 11.1,42.85 8.57,42.85 6.62,44.8 | C20.2 14.75,44.56 16.41,42.91 | U8.4 12.3,33.9 11.2,35 11.2,36.3 10.8,36.7 2.07,36.7 2.06,36.69 | 2.06,36.69 CH3.2 CH1.2 2.06,45.8 1.99,45.87 2.38,46.26 5.16,46.26 6.62,44.8 | 2.06,36.69 CH2.2 | L3.2 7.88,46.05 6.62,44.8
  Top 0.254: C9.2 21,39.42 20.08,40.34 20.08,42.51 19.71,42.88 | U1.12 36.73,45.6 36.64,45.69
  Top 0.406: U7.4 18.44,42.88 19.71,42.88 21.61,42.88 23.23,44.5 25.52,44.5 26.19,45.17 29.32,45.17 29.84,45.69 29.85,45.69 29.94,45.78 36.57,45.78 36.64,45.71 36.64,45.69
  pour Top (isolate 0.254): 0.3,33 20.19,32.99 20.1,33.66 20.1,41.43 20.08,42 20.04,42.46 14.07,46.63 0.39,46.6
  pour Bottom (isolate 0.254): 0.38,46.62 0.3,33 20.1,33 20.1,42.43 14.04,46.65
BOOT1  (via drill 0.6)
  Top 0.2: U1.28 48.17,52.23 v48.5,51.9
  Bottom 0.2: v48.5,51.9 46.45,51.9 R21.2
CAPS_LOCK
  Top 0.2: U1.56 24.74,50.73 15.96,59.51 15.96,63.3 16.49,63.83 19.84,63.83 20.26,64.25 20.26,65.54 R23.2
DAC1
  Top 0.2: U1.20 41.47,48.23 41.7,48 41.7,45.9 42.1,45.5 R39.2
DAC2
  Top 0.2: U1.21 41.62,48.73 R38.2
DIN1
  Top 0.2: D2.1 39.8,37.2 39.2,37.8 39.2,40.6 36.23,43.57 U1.11
DIN2
  Top 0.2: D3.1 40.4,38.95 40.4,41 37.73,43.67 U1.14
DIN3
  Top 0.2: U1.15 38.23,43.97 41,41.2 41,40.95 D4.1
DIN4
  Top 0.2: 41.35,42.2 D5.1 | 41.4,42.15 D5.1 | U1.16 38.73,44.47 40.9,42.3 41.25,42.3 D5.1
DIN5
  Top 0.2: U1.17 40.68,45.47 D6.1
DIN6
  Top 0.2: A_~.P$4 4.7,11.5 4.85,11.35 | 4.85,11.35 5.2,11 5.2,8.9 7.1,7 8.9,7 9.4,6.5 9.4,4.3 9.1,4 | SHIFT.P$4 9.1,4 | Q_--.P$4 7.06,19 | 7.06,19 7.13,18.93 9.23,18.93 10.2,19.9 10.2,22 9.3,22.9 4.88,22.9 2.81,24.97 2.81,26.21 1_!.P$4 5.3,26.5 6.06,27.26 12.88,27.26 13.37,27.75 21.21,27.75 23.26,29.8 37.67,29.8 39.57,31.7 45.2,31.7 50.35,36.85 50.37,36.85 50.37,45.77 48.36,47.78 46.23,47.78 44.78,49.23 U1.22 | 7.06,19 6.5,19 6,18.5 6,12.5 4.85,11.35 | 9.1,4 9.4,3.7 9.4,3.3 12,0.7 73.76,0.7 76.35,3.29 76.35,9.61 77.47,10.73 80.04,10.73 81.96,12.65 84.64,12.65 84.95,12.96 84.95,17.96 83.94,18.97 82.73,18.97 P_".P$4 82.59,18.89
DIN7
  Top 0.2: S_|.P$4 12.76,11.5 | U1.23 45.11,49.73 46.6,48.24 48.75,48.24 50.97,46.02 50.97,36.57 45.5,31.1 39.67,31.1 37.77,29.2 23.39,29.2 21.47,27.28 13.79,27.28 13,26.49 | RETURN.P$4 78.63,11.43 77.39,11.43 75.78,9.82 75.78,3.48 73.53,1.23 19.58,1.23 16.82,3.99 16.71,3.99 | Z_TAB.P$4 16.71,3.99 | 16.71,3.99 17.06,4.34 17.06,7.2 12.76,11.5 | 12.76,11.5 12.84,11.5 13.37,12.03 13.37,18.08 14.33,19.04 15.46,19.04 | 15.46,19.04 W_+.P$4 | 13,26.49 2_@.P$4 | 15.46,19.04 17.4,19.04 17.7,19.34 17.7,21.79 13,26.49
DIN8
  Top 0.2: U1.24 45.47,50.23 46.9,48.8 49,48.8 51.6,46.2 51.6,36.3 45.8,30.5 39.8,30.5 38.14,28.84 38.14,28.11 37.66,27.63 22.76,27.63 21.67,26.54 21.15,26.54 21.02,26.41 | 3_#.P$4 19.12,26.52 20.92,26.52 21.02,26.41 | 23.18,4.08 X_:.P$4 24.94,4 | SPACE.P$4 74.16,3.86 74.16,2.77 73.11,1.72 27.22,1.72 24.94,4 | D_\\.P$4 21.17,11.5 | 21.17,11.5 21.54,11.87 21.54,17.96 22.55,18.97 23.87,18.97 | 23.87,18.97 E_=.P$4 | 24.94,4 25.35,4.41 25.35,7.32 21.17,11.5 | 23.87,18.97 25.18,18.97 25.51,19.3 25.51,21.93 21.02,26.41
DIN9
  Top 0.2: U1.25 45.87,50.73 47.2,49.4 49.1,49.4 52.2,46.3 52.2,36.1 46.45,30.35 46.45,27.98 46.24,27.77 38.53,27.77 37.89,27.13 30.33,27.13 29.62,26.43 | 0__.P$4 78.38,26.5 78.38,26.75 77.84,27.29 72.89,27.29 72.51,27.67 72.51,29.11 71.7,29.92 70.45,29.92 69.62,30.75 69.62,31.82 68.59,32.85 65.96,32.85 64.67,31.56 64.67,24.91 65.89,23.69 67.68,23.69 68.67,22.7 68.67,18.22 67.67,17.22 64.99,17.22 64.72,16.95 64.72,8.86 64.9,8.68 67.41,8.68 68.6,7.49 68.6,3.26 67.43,2.09 35.54,2.09 33.63,4 | F_{.P$4 29.61,11.5 | 29.61,11.5 30.2,12.09 30.2,18.2 30.94,18.94 32.24,18.94 | 32.24,18.94 R_<.P$4 | C_?.P$4 33.63,4 | 33.63,4 33.82,4.19 33.82,7.29 29.61,11.5 | 32.24,18.94 33.52,18.94 33.74,19.16 33.74,22.31 29.62,26.43 | 29.62,26.43 29.52,26.53 28.33,26.53 4_$.P$4
DIN10
  Top 0.2: U1.26 46.27,51.23 47.5,50 49.2,50 52.8,46.4 52.8,35.8 46.95,29.95 46.95,27.72 46.52,27.29 38.76,27.29 37.98,26.51 | 40.21,4 V_/.P$4 41.98,4 42.06,4.08 | BS_DEL.P$4 72.19,34 71.6,33.41 65.49,33.41 64.1,32.02 64.1,24.73 65.7,23.13 67.53,23.13 68.17,22.49 68.17,18.57 67.34,17.74 64.81,17.74 64.17,17.1 64.17,8.29 64.35,8.11 67.25,8.11 68.03,7.33 68.03,3.49 67.19,2.65 43.5,2.65 42.06,4.08 | G_}.P$4 37.86,11.5 | 37.86,11.5 38.42,12.06 38.42,17.93 39.49,19 T_>.P$4 42.02,19 42.29,19.27 42.29,22.2 37.98,26.51 | 42.06,4.08 42.23,4.25 42.23,7.13 37.86,11.5 | 37.98,26.51 5_%.P$4
DIN11
  Top 0.2: U1.27 47.37,51.73 48,51.1 48,51.08 48.95,51.08 53.4,46.63 53.4,35.5 47.59,29.69 47.59,27.47 46.62,26.5 | 69.09,37.89 69.15,37.89 | 69.15,37.89 72.44,37.89 75.6,41.05 CAPS.P$4 | 69.15,37.89 63.62,32.36 63.62,24.57 65.51,22.68 67.09,22.68 67.73,22.04 67.73,18.89 67.04,18.2 64.63,18.2 63.62,17.19 63.62,8.11 64.17,7.56 67.03,7.56 67.55,7.04 67.55,3.84 66.91,3.2 51.21,3.2 50.41,4 | 6_&.P$4 46.62,26.5 | 46.62,26.5 50.51,22.61 50.51,19.23 50.28,19 Y_[.P$4 49.05,18.95 47.89,18.95 46.84,17.9 46.84,11.85 46.49,11.5 | H_^.P$4 46.49,11.5 | B_*.P$4 50.41,4 | 50.41,4 50.7,4.29 50.7,7.29 46.49,11.5
DIN12
  Top 0.2: U1.29 48.87,52.73 49.8,51.8 | 49.8,51.8 49.8,51.1 54,46.9 54,35.4 53,34.4 53,31.1 55.01,29.09 55.01,26.76 54.76,26.51 | 49.8,51.8 69.26,51.8 72.06,49 ALT.P$4 | N_,.P$4 58.74,4 59.06,4.32 59.06,7.08 54.65,11.49 | 54.65,11.49 53,11.49 52.96,11.53 53.47,11.53 J_..P$4 | 54.65,11.49 55.77,12.61 55.77,18.7 56.07,19 U_].P$4 58.78,19 58.96,19.18 58.96,22.31 54.76,26.51 | 54.76,26.51 7_'.P$4
DIN13
  Top 0.2: U1.30 49.07,53.23 49.9,52.4 69.51,52.4 71.89,50.02 74.26,50.02 | M_.P$4 66.92,4 67.12,4.2 67.12,6.73 66.98,6.87 63.99,6.87 63.12,7.74 63.12,11.21 62.83,11.5 | 61.64,11.24 K_.P$4 62.83,11.5 | 62.83,11.5 63.14,11.81 63.14,17.65 64.51,19.02 65.88,19.02 I_.P$4 66.89,19 67.19,19.3 67.19,21.8 66.91,22.08 65.43,22.08 63.03,24.48 63.03,26.31 62.85,26.49 8_(.P$4 62.92,26.5 63.19,26.77 63.19,32.56 70.19,39.56 70.19,41.51 77.09,48.41 77.09,49.64 76.71,50.02 74.26,50.02 | ESC.P$4 75.6,53.22 74.19,51.81 74.19,50.09 74.26,50.02
DIN14  (via drill 0.6)
  Top 0.2: v67.9,31.9 67.82,31.9 | L_.P$4 71.57,11.5 72.11,12.04 72.11,18 73.06,18.95 74.25,18.95 O_:.P$4 75.76,19 76.03,19.27 76.03,23.95 74.88,25.1 73.34,25.1 71.94,26.5 9_).P$4 69.19,27.61 65.52,27.61 65.14,27.99 65.14,31.07 66.19,32.12 67.68,32.12 v67.9,31.9 | 67.83,31.97 v67.9,31.9 | U1.49 30.13,54.23 30.29,54.07 30.29,53.54 v30.74,53.09
  Bottom 0.2: v67.9,31.9 61.7,38.1 42.7,38.1 38.1,42.7 33.3,42.7 29.3,46.7 29.3,51.65 v30.74,53.09
DIN_2
  Top 0.2: 6_&.P$2 7_'.P$1
DIN_3
  Top 0.2: I_.P$2 O_:.P$1
DIN_4
  Top 0.2: J_..P$2 K_.P$1
DIN_5
  Top 0.2: B_*.P$2 N_,.P$1
GND  (via drill 0.6)
  Top 0.2: U1.18 39.3,47.23 38.88,46.81 32.01,46.81 31.9,46.92 | U1.63 29.93,47.23 30.3,47.6 30.3,47.8 30.7,48.2 | C6.2 27.6,57.83 27.6,56.2 28.95,54.85 30.59,54.85 31.67,53.77 31.67,52.51 31.1,51.94 v31.1,49.5 30.7,49.1 30.7,48.2 | 42.7,56.58 C7.2 | 32.3,35.8 30.5,35.8 29.61,36.69 C1.2 29.6,35.7 29.4,35.5 v29.3,35.5 | 32.3,35.8 35.3,35.8 35.6,36.1 35.6,36.23 C2.2 | C5.2 33.49,38.99 32.2,37.7 32.2,35.9 32.3,35.8 | 30.7,48.2 31.7,48.2 31.9,48 31.9,46.92 | L3.1 9.96,48.56 10.47,48.05 15.13,48.05 I2C1.4 18.68,44.5 19.19,45.01 21.9,45.01 22.49,45.6 25.06,45.6 25.66,46.2 28.53,46.2 28.63,46.3 30.83,46.3 30.98,46.45 31.43,46.45 31.9,46.92 | C8.2 29.97,43.52 v30.01,43.56
  Top 0.406: BATT.1 79.06,60.35 52.82,60.35 51.27,61.9 44.27,61.9 43.47,61.1 43.47,56.95 C7.2 44.54,56.38 UART1.3
  Bottom 0.2: C27.2 36.85,50.6 | 36.9,50.53 C27.2 | C27.2 36.95,50.6 37.7,50.6 38.1,51 C28.2 38.91,51.41 42.29,51.41 42.34,51.46 | v31.1,49.5 31.13,49.47 C25.2 34.74,49.47 C26.2 34.9,49.5 35.9,50.5 C27.2 | 14.83,59.73 U2.GND4 16.64,60.2 17.1,60.2 18.1,61.2 18.1,62.2 18.6,62.7 18.6,63.5 | 14.83,59.73 14.5,59.4 14.5,53.2 14.85,52.85 | 14.85,52.85 15.1,52.6 16.09,52.6 U2.6 17.92,52.68 18.3,52.3 18.3,51.87 R17.1 19.34,50.06 19.7,49.7 21.9,49.7 22.3,50.1 22.3,50.79 C29.2 23.21,51.7 23.8,51.7 24.17,52.07 C11.2 24.4,52.78 | 11.87,49.87 14.85,52.85 | U2.GND2 1.52,48.72 3.2,50.4 11.34,50.4 11.87,49.87 | 46.85,67.6 C15.2 46.65,67.5 | C14.2 48.57,70.07 | C18.2 55.55,66.95 | 55.28,71.6 C13.2 | 16.18,47 I2C1.4 | UART1.3 45.8,54.92 R21.1 45.85,53 | 45.92,55 UART1.3 | 18.6,65.16 C12.2 | 18.6,65.16 18.6,63.5 | RS422.6 83.01,37.6 C16.2 82.96,37.55 82.96,38.5 78.9,42.56 U$2.1 78.8,45.6 78.8,46.5 78.3,47 76.6,47 | R30.1 73.11,37.65 72.46,37 72.46,31.5 U5.4 | 16.3,46.88 I2C1.4 | 61.4,69.7 C19.2 | 42.34,51.46 48.5,45.3 DACOUT.3 52.12,45.18 52.4,44.9 52.4,39.1 52.9,38.6 72.51,38.6 R30.1 | 72.81,38.3 R30.1 | X1.GND 12.67,64.03 13,63.7 18.4,63.7 18.6,63.5 | 14.83,59.73 12.48,62.08 U2.GND3 1.82,64.24 v2.86,65.28 | U6.P$4 36.25,66.65 | 36.25,66.65 36.3,66.7 38.3,66.7 | 38.8,66.7 38.3,66.7 | 38.8,66.7 39.1,66.7 39.25,66.55 U6.P$10 | U6.P$9 38.75,66.65 38.8,66.7 | U6.P$8 38.25,66.65 38.3,66.7 | 36.25,66.65 36.25,69.35 37,70.1 45.85,70.1 C10.2 | 11.87,49.87 11.87,48.98 U2.GND1 14.6,48.58 I2C1.4 | v3.2,19.7 7.9,24.4 11.7,24.4 JP15.1 17.42,24.3 v18.18,25.42 20.1,24.43 20.41,24.74 | v68.54,25.19 68.96,24.67 v60.04,25.13 57.6,24.78 v51.86,25.29 49.8,24.8 49.54,24.69 49.26,24.73 v43.44,25.31 35.83,24.57 v34.88,25.16 20.41,24.74
  Bottom 0.2: v68.54,25.19 v84.13,24.61 | v57.5,57.9 57.5,56 58.6,54.9 60.94,54.9 | v57.9,46 57.9,48.2 58.7,49 60.98,49 | v78.72,49.87 76.6,47 | 42.34,51.46 43.43,52.55 | 43.43,52.55 UART1.3 | 62.94,48.96 U$2.29 | 60.98,49 U$2.29 | U$2.29 62.92,48.98 64.17,48.98 64.46,48.69 64.46,46.81 61.8,44.15 v61.8,43.1 63.45,41.45 C17.2 65.7,41.61 U$2.12 65.76,45.56 65.76,46.64 66.12,47 76.6,47 | 60.94,54.9 61.24,55.2 U$2.28 62.93,55.17 64.04,55.17 65.94,57.07 79.69,57.07 80.25,57.63 80.25,64.57 80.09,64.73 | 60.94,54.9 60.94,49.04 60.98,49 | v77.52,4.97 76.27,6.25 v72.99,13.25 69.96,19.94 v68.54,25.19 | v18,5.06 18,10.19 v26.61,17.22 20.41,22.22 20.41,24.74 | 20.41,24.74 19.3,25.85 19.3,29.2 23.13,29.2 29.33,35.4 29.33,35.52 v29.31,35.5 v29.3,35.5 27.59,37.21 27.35,37.21 | C30.2 42.74,53.24 43.43,52.55 | I2C1.4 17.58,48.2 25.93,48.2 27.95,46.18 C3.2 | PROG.1 18.06,69.94 17.44,69.32 17.44,65.52 17.66,65.3 18.46,65.3 18.6,65.16 | 27.35,37.21 26.68,37.21 26.19,36.72 24.83,36.72 C4.2 | 27.35,37.21 27.38,37.24 27.38,41.73 27.95,42.3 C3.2 | v30.01,43.56 29.19,42.74 28.12,42.74 C3.2
  Bottom 0.254: 36.73,50.6 C27.2
  Bottom 0.406: 58.7,66.2 U3.2 56.8,66.2 56.1,66.9 | 58.7,66.2 58.9,66.4 58.9,69.1 59.5,69.7 C19.2 | 58.7,66.2 58.9,66 58.9,64.5 59.51,63.89 61.66,63.89 62.5,64.73 80.09,64.73 BATT.1 | 56.1,66.9 54.85,66.9 C18.2 | 55.28,71.6 56,71.6 56.4,71.2 56.4,67.2 56.1,66.9 | U4.P$_2 53.6,70.9 54.1,71.4 54.8,71.4 C13.2 54.28,72.6 51.7,72.6 51,71.9 51,71.3 50.7,71 49.6,71 48.67,70.07 48.57,70.07 | C10.2 48.16,70.15 C14.2 48.21,70.04 C23.2 46.85,67.6
  pour Bottom (isolate 0.254): 0.4,74.72 0.33,47.48 0.45,47.42 14.28,47.45 20.9,43.02 20.9,32.4 0.29,32.4 0.3,0.3 89.8,0.34 89.68,74.31 86.7,74.72
  pour Top (isolate 0.254): 0.43,74.68 0.36,47.53 0.43,47.43 14.27,47.44 20.6,43.18 20.84,43.02 20.9,42.4 20.9,32.98 20.89,32.38 0.3,32.4 0.3,0.3 89.7,0.3 89.85,74.7
I2C1_SCL
  Top 0.2: U1.61 25.97,48.23 25.5,48.7 22.3,48.7 21.3,47.7 21.3,46.96 I2C1.2
I2C1_SDA
  Top 0.2: U1.62 25.57,47.73 25.1,48.2 22.7,48.2 22.6,48.1 22.6,46.3 21.9,45.6 20.12,45.6 I2C1.3
LCD_SCS  (via drill 0.6)
  Top 0.2: U1.33 38.73,62.67 37,64.4 37,65.55 v35.37,67.18
  Bottom 0.2: U6.P$3 35.75,66.8 v35.37,67.18
N$1
  Top 0.2: U1.6 33.73,43.03 32.5,41.8 32.5,39.9 31.3,38.7 31.3,37.01 R1.1
N$2
  Top 0.2: R1.2 34.56,36.93 C2.1 34.9,37.23 34.9,39.1 35.96,40.16 Q1.1
N$3
  Top 0.2: U1.5 33.23,43.23 31.7,41.7 31.7,40.69 Q1.2 31.17,40.13 C1.1
N$4
  Top 0.2: U1.47 31.73,57.17 31.7,57.2 30.8,57.2 30.1,57.9 C6.1
N$5
  Top 0.2: U1.31 42.15,53.73 C7.1
N$6
  Top 0.2: U1.4 32.73,43.53 28.9,39.7 25.07,39.7 Q2.2
  Bottom 0.254: Q2.2 24.69,38.56 C4.1
N$7
  Top 0.2: U1.3 32.23,43.83 28.8,40.4 26.22,40.4 24.88,41.74 24.88,42.43 Q2.1
  Bottom 0.2: C3.1 24.98,42.91 Q2.1
N$8
  Top 0.2: U1.1 31.09,44.64 29.35,44.64 29.21,44.5 27.35,44.5 26.99,44.14 26.99,43.55 C8.1 26.97,42.67 27.17,42.47 D1.C
N$9
  Bottom 0.2: 19.32,61.3 R5.2 18.52,60.5 18.5,60.5 17.6,59.6 17.6,58.5 17.28,58.18 U2.1
N$10
  Bottom 0.2: U2.2 17.18,57.08 18.4,58.3 18.4,59 18.6,59.2 19.39,59.2 R6.2
N$11
  Bottom 0.2: 19.34,57.2 R7.2 19.3,57.1 18.3,57.1 17.18,55.98 U2.3
N$12  (via drill 0.6)
  Top 0.2: D1.A 27.17,36.03 v27.5,35.7
  Bottom 0.2: v27.5,35.7 27.5,35 24.6,32.1 10.02,32.1 JP16.1
N$13
  Bottom 0.2: U2.5 18.57,53.78 R8.2
N$14
  Bottom 0.2: U2.7 17.72,51.58 18.2,51.1 18.2,50.3 19.3,49.2 25.5,49.2 27.8,51.5 27.8,52.85 29.19,54.24 29.19,55.99 29.81,56.61 30.23,56.61 R9.2 30.32,56.7
N$15
  Bottom 0.2: 30.31,54.5 R10.2 | 30.4,54.63 R10.2 | U2.8 17.22,50.48 19,48.7 25.9,48.7 28.5,51.3 28.5,52.69 R10.2 | R10.2
N$16
  Bottom 0.2: R22.2 61.1,72.6 | 62.6,69.65 C19.1
  Bottom 0.406: U3.5 61.55,65.25 62.2,65.9 62.2,69.35 C19.1 | 62.75,69.9 C19.1 | 61.1,72.6 61.8,72.6 62.6,71.8 62.6,69.75 C19.1
  Bottom 0.61: BATT.2 83.55,67.27 80.41,70.41 | 62.75,69.9 79.9,69.9 80.41,70.41 | 80.41,70.41 80.41,72.26 POWER.1
N$17  (via drill 0.6)
  Top 0.2: v16.9,61.2 17.8,62.1 20.3,62.1 21.3,63.1 22.9,63.1 23.3,62.7 26.6,62.7 26.9,63 28.1,63 28.7,62.4 28.7,61.83 R3.2
  Bottom 0.2: X1.D- 10.27,63.73 11.3,62.7 15.4,62.7 v16.9,61.2
N$18  (via drill 0.6)
  Top 0.2: v17.1,62.9 17.2,63 20.4,63 21,63.6 23.3,63.6 23.6,63.3 26.2,63.3 26.7,63.7 28.42,63.7 30.3,61.82 30.3,60.6 30.7,60.2 31.34,60.2 R2.2 31.57,60 R4.1
  Bottom 0.2: X1.D+ 11.07,63.83 11.7,63.2 16.8,63.2 v17.1,62.9
N$19
  Bottom 0.2: 45.47,57.56 UART1.2 45.78,57.44 40.66,57.44 R18.2
N$20
  Bottom 0.2: UART1.1 45.7,59.9 39.07,59.9 R16.2 37.21,58.04
N$21
  Top 0.2: U1.60 26.5,48.73 25.41,49.82 24.04,49.82 14.86,59 14.86,64.59 16.74,66.47 24.08,66.47 PROG.2
N$22
  Bottom 0.406: U4.P$_3 55.05,69.95 C13.1 | U4.P$_1 51.95,71.85 51.7,71.6 51.7,70.1 51.85,69.95 U4.P$_3 | U4.P$_3 52.83,69.25 52.1,68.53 52.1,67.42 L2.2
N$23
  Bottom 0.2: R22.1 57.85,72.6 CHRG.A
N$24
  Bottom 0.2: CHRG.C 57.4,67.35 U3.3
N$25  (via drill 0.6)
  Top 0.2: D2.2 44.03,37.2 v44.1,37.13 | P_".P$1 81.49,21 76.78,25.71 73.51,25.71 71.8,27.42 71.8,28.84 71.31,29.33 69.91,29.33 v68.49,30.75
  Bottom 0.2: v44.1,37.13 44.57,37.6 61.34,37.6 66.49,32.45 66.49,31.71 67.5,30.7 68.42,30.7 v68.49,30.75
N$26
  Top 0.2: P_".P$2 85.5,21 84.23,19.73 81.46,19.73 81.22,19.49 81.22,13.91 80.77,13.46 78.74,13.46 RETURN.P$1
N$27
  Top 0.2: SPACE.P$1 74.3,10 73.58,10.72 73.58,11.87 74.21,12.5 80.71,12.5 81.61,13.4 83.4,13.4 RETURN.P$2
N$28
  Top 0.2: SPACE.P$2 79.1,9.86 79.48,10.24 80.37,10.24 80.82,10.69 84.59,10.69 84.98,11.08 84.98,12.1 85.44,12.56 85.44,19.24 85.55,19.35 85.61,19.41 86.28,20.08 88.5,20.08 88.9,20.48 88.9,21.49 88.92,21.51 88.62,21.81 81.55,21.81 80.26,23.1 80.26,27.9 79.6,28.56 78.76,28.56 0__.P$1 78.8,28.4
N$29
  Bottom 0.2: 32.1,58.85 R15.2 | U2.4 19.21,54.88 R13.2 19.42,54.98 20.4,54 22.4,54 | 22.4,54 23.1,54 23.7,54.6 24.6,54.6 25.1,55.1 25.1,57.3 24.7,57.7 R12.2 23.01,57.72 R11.2 23.17,59.3 23.6,59.3 24.1,59.8 24.1,60.5 | C11.1 22.47,53.93 22.4,54 | L1.1 20.15,67.25 20.15,67.15 20.6,66.7 20.6,65.96 C12.1 21.8,64.7 21.8,63.9 24.1,61.6 24.1,60.5 | R15.2 32,58.95 31.75,58.95 31.75,59.75 31.1,60.4 28.9,60.4 28.2,61.1 27.1,61.1 26.5,60.5 24.1,60.5 | R15.2 33.53,58.89 R14.2
N$30
  Top 0.2: 0__.P$2 81.09,28.5 80.29,29.3 78.84,29.3 77.48,30.66 77.48,35.47 76.96,35.99 BS_DEL.P$1
N$31
  Top 0.2: D3.2 44.8,38.9 45.6,38.1 45.6,36.3 44.57,35.27 40.77,35.27 37.1,31.6 22.14,31.6 20.74,30.2 13.3,30.2 12.72,29.62 5.06,29.62 5.04,29.64 3.9,28.5 1_!.P$1
N$32
  Top 0.2: 1_!.P$2 2_@.P$1
N$33
  Top 0.2: SHIFT.P$1 6.54,6 1.97,10.57 1.91,10.57 1.63,10.85 1.63,12.09 1.81,12.27 4.66,12.27 5.44,13.05 5.44,19.31 5.84,19.71 8.9,19.71 9.59,20.4 9.59,21.64 8.83,22.4 4.5,22.4 1.7,25.2 1.7,26.9 1.84,27.04 1.85,27.04 2.09,27.28 5.08,27.28 5.6,27.8 12.67,27.8 14.06,29.19 21.11,29.19 22.32,30.4 37.44,30.4 41.12,34.08 45.18,34.08 46.8,35.7 46.8,38.7 45.4,40.1 45.4,43.05 D6.2
N$34
  Top 0.2: SHIFT.P$2 Z_TAB.P$1
N$35
  Bottom 0.406: C23.1 49.91,69.89 U4.P$_4
N$36
  Top 0.2: Z_TAB.P$2 X_:.P$1
N$37
  Top 0.2: X_:.P$2 C_?.P$1
N$38
  Top 0.2: C_?.P$2 V_/.P$1
N$39
  Top 0.2: A_~.P$2 S_|.P$1
N$40
  Top 0.2: F_{.P$2 G_}.P$1
N$41
  Top 0.2: CH3.1 6.4,38 R40.1
N$42
  Top 0.2: R39.1 44.6,45.5 46.8,43.3 46.8,42.3 48.5,40.6 DACOUT.1
N$43
  Top 0.2: R38.1 44.7,47.6 45.5,46.8 45.5,45.64 DACOUT.2
N$44
  Top 0.2: R40.2 11,38 11.7,37.3 11.7,35.5 12.04,35.16 U8.3
N$45
  Top 0.2: R41.1 5.4,35.4 4.7,34.7 CH2.1
N$46
  Top 0.2: U8.5 15.6,33.9 14.7,33 11.8,33 10.4,34.4 10.4,35.25 R41.2
N$47
  Top 0.2: R43.1 22.82,36.07 20.66,36.07 20.33,36.4 18.45,36.4 U8.7 18.39,36.41 16.93,36.41 16.78,36.26 16.78,35.38 17,35.16 U8.6
N$48
  Top 0.2: U8.1 14.79,37.7 15,37.5 15,36.5 | 15,36.5 17,34.5 22.35,34.5 R42.1 | U8.2 14.94,36.44 15,36.5
N$49
  Top 0.2: CH1.1 8.3,40.8 R44.1
N$50
  Top 0.2: U7.3 16.14,41.63 15.5,41 10.45,41 R44.2
N$51
  Top 0.2: R45.1 22.5,38.2 22.2,38.5 20.2,38.5 20.1,38.6 20.1,38.79 19.8,39.09 U7.1 18.37,39.05 16.93,39.05 16.78,39.2 16.78,40.15 17.03,40.4 18.45,40.4 U7.2
N$52
  Bottom 0.2: PROG.3 25.83,64.04 25.73,63.94 R20.1
N$53
  Top 0.2: D_\\.P$2 F_{.P$1
N$54
  Top 0.2: S_|.P$2 D_\\.P$1
N$55
  Top 0.2: A_~.P$1 4.31,13.49 4.89,14.07 4.89,19.69 5.41,20.21 8.74,20.21 9.09,20.56 9.09,21.45 8.79,21.75 4.15,21.75 1.2,24.7 1.2,27.1 1.8,27.7 4.5,27.7 6.02,29.22 6.03,29.21 13.14,29.21 13.63,29.7 20.95,29.7 22.25,31 37.27,31 40.95,34.68 44.88,34.68 46.2,36 46.2,38.4 44.8,39.8 44.8,41.6 44.3,42.1 D5.2
N$56
  Top 0.2: Q_--.P$1 4,21 0.7,24.3 0.7,28 2.1,29.4 3.8,29.4 4.51,30.11 12.48,30.11 13.07,30.7 20.41,30.7 21.91,32.2 36.88,32.2 40.45,35.77 44.17,35.77 45,36.6 45,37.7 44.6,38.1 42,38.1 41.6,38.5 41.6,39.3 42.1,39.8 43.05,39.8 D4.2
N$57
  Top 0.2: Q_--.P$2 W_+.P$1
N$58
  Top 0.2: W_+.P$2 E_=.P$1
N$59
  Top 0.2: E_=.P$2 R_<.P$1
N$60
  Top 0.2: R_<.P$2 T_>.P$1
N$61
  Top 0.2: 2_@.P$2 3_#.P$1
N$62
  Top 0.2: 3_#.P$2 4_$.P$1
N$63
  Top 0.2: 4_$.P$2 5_%.P$1
N$64
  Top 0.2: BS_DEL.P$2 78.26,36 77.58,36.68 77.58,42.99 77.15,43.42 75.68,43.42 CAPS.P$1
N$65
  Top 0.2: CAPS.P$2 77.93,43.5 77.51,43.92 77.51,50.4 76.89,51.02 75.62,51.02 ALT.P$1
N$66
  Top 0.2: ALT.P$2 78.13,51 77.42,51.71 77.42,57.86 76.79,58.49 ESC.P$1
N$67
  Bottom 0.2: S1.7 56.1,35.64 56.1,36.5 56.6,37 61.14,37 65.44,32.7 65.44,31.91 67.44,29.91 70.09,29.91 71.4,28.6 74.36,28.6 74.83,29.07 U5.3
N$68
  Bottom 0.2: S1.8 54.7,34.3 55.2,33.8 63.44,33.8 64.87,32.37 64.87,31.52 67.09,29.3 69.6,29.3 71,27.9 74.96,27.9 76.09,29.04 U5.2
N$69
  Bottom 0.2: U5.5 73.66,35.49 73.66,34.1 75.36,32.4 76.56,32.4 76.76,32.2 76.76,28.5 77.96,27.3 R24.2
N$70
  Top 0.2: 8_(.P$2 9_).P$1
N$71
  Top 0.2: 7_'.P$2 8_(.P$1
N$72
  Top 0.2: 5_%.P$2 6_&.P$1
N$73
  Top 0.2: T_>.P$2 Y_[.P$1
N$74
  Top 0.2: Y_[.P$2 U_].P$1
N$75
  Top 0.2: U_].P$2 I_.P$1
N$76
  Top 0.2: K_.P$2 L_.P$1
N$77
  Bottom 0.2: U5.6 74.96,35.47 74.96,34.1 75.96,33.1 77.06,33.1 78.06,32.1 78.06,30.6 78.66,30 R25.2
N$78
  Top 0.2: N_,.P$2 M_.P$1
N$79
  Top 0.2: V_/.P$2 B_*.P$1
N$80
  Top 0.2: G_}.P$2 H_^.P$1
N$81
  Top 0.2: H_^.P$2 J_..P$1
N$82
  Bottom 0.2: R30.2 R28.2 76.09,37.69 U5.7
N$83
  Bottom 0.2: R27.2 78.86,32.15 78.86,32.8 79.46,33.4 R26.1 79.31,34.5 78.36,34.5 77.36,35.49 U5.8
N$84
  Bottom 0.2: RS422.5 82.87,35.06 R29.1 82.51,34.8 81.36,34.8 81.06,35.1 81.06,36.1 79.16,38 R28.1
N$85
  Bottom 0.2: RS422.4 83.09,32.52 R29.2 81.61,32.1 R27.1
N$86
  Bottom 0.2: RS422.3 83.03,29.98 R25.1
N$87
  Bottom 0.2: RS422.2 83.15,27.44 R24.1
N$88
  Top 0.2: R23.1 20.21,68.85 22.49,71.13 43,71.13 53.05,61.08 74.11,61.08 76.13,63.1 78.31,63.1 78.72,63.51 78.72,64.05 CAPS\.C | 78.76,64.09 CAPS\.C | 78.73,64.06 CAPS\.C | CAPS\.C
N$89
  Top 0.2: R31.1 17.82,68.32 18.12,68.62 19.3,68.62 22.21,71.53 43.24,71.53 53.21,61.56 73.98,61.56 75.64,63.22 75.65,63.22 75.9,63.47 75.9,63.74 ALT\.C | 76.25,63.99 ALT\.C | 76.15,63.99 ALT\.C
RST
  Top 0.2: U1.7 34.23,42.73 33.5,42 C5.1
SD0  (via drill 0.6)
  Top 0.2: U1.39 35.73,57.71 v35.38,58.06
  Bottom 0.2: 32.26,56.6 R9.1 33.61,56.77 R14.1 34.26,56.94 v35.38,58.06
SD1  (via drill 0.6)
  Top 0.2: U1.40 35.23,55.17 v35.5,54.9
  Bottom 0.2: 32.12,55.08 R10.1 32.12,54.28 | 32.12,55.08 31.3,55.9 31.3,57.95 R15.1 | 32.12,55.08 32.59,55.08 33.35,55.84 34.56,55.84 v35.5,54.9
SD2  (via drill 0.6)
  Top 0.2: U1.51 27.67,53.23 25.3,55.6 25.3,56.3 24.5,57.1 23.1,57.1 22.5,57.7 22.5,61.9 v22.2,62.2
  Bottom 0.2: R5.1 21.33,61.33 v22.2,62.2 23.01,61.39 R11.1
SD3  (via drill 0.6)
  Top 0.2: U1.52 27.47,52.73 v24.3,55.9
  Bottom 0.2: R6.1 22,58.43 22,56.4 22.4,56 R12.1 23.09,55.9 v24.3,55.9
SDCLK  (via drill 0.6)
  Top 0.2: U1.53 26.03,52.23 v25.9,52.3
  Bottom 0.2: 21.21,51 21.08,50.87 | 21.08,50.87 R17.2 | 21.08,50.87 21.08,51.88 21.1,51.9 | 21.1,51.9 22.7,51.9 22.9,52.1 23.1,52.1 23.3,52.3 23.3,53.6 23.7,54 25,54 25.3,53.7 25.3,52.9 v25.9,52.3 | 21.1,51.9 21.1,52.95 R8.1
SDCMD  (via drill 0.6)
  Top 0.2: U1.54 26.73,51.73 26.3,51.3 25.5,51.3 24.8,52 24.8,53.2 23.2,54.8 v22.5,54.8
  Bottom 0.2: R7.1 21.12,57.12 R13.1 21.41,54.8 v22.5,54.8
SHIFT_LOCK
  Top 0.2: U1.57 24.5,50.23 15.39,59.34 15.39,63.71 16.21,64.53 17.42,64.53 17.79,64.9 17.79,65.65 R31.2
SPI2_MOSI  (via drill 0.6)
  Top 0.2: U1.36 37.23,57.13 37.8,57.7 37.8,61.7 36.4,63.1 34,63.1 v33.62,63.48
  Bottom 0.2: U6.P$2 35.25,64.07 34.87,63.69 33.83,63.69 v33.62,63.48
SPI2_SCK  (via drill 0.6)
  Top 0.2: U1.34 38.23,62.27 36.7,63.8 34.83,63.8 v33.53,65.1
  Bottom 0.2: U6.P$1 33.63,65.2 v33.53,65.1
USART1_RX  (via drill 0.6)
  Top 0.2: R19.1 33.73,58.36 U1.43 33.73,54.65 v33.59,54.51
  Bottom 0.2: S1.1 54.7,48.6 48,55.3 48,57.7 46.9,58.8 40.32,58.8 R18.1 38.75,57.98 38.35,57.58 38.35,55.62 35.88,53.15 35.5,53.15 35.18,52.83 34.53,52.83 33.84,53.52 33.84,54.26 v33.59,54.51
USART1_TX  (via drill 0.6)
  Top 0.2: U1.42 34.23,55.18 34.71,54.7 34.71,53.89 v34.91,53.69
  Bottom 0.2: S1.2 56,43.53 56,48.1 48.7,55.4 48.7,58 47.4,59.3 47.4,60.8 46.5,61.7 45.3,61.7 44.5,60.9 44.5,60.7 44.3,60.5 38.35,60.5 36.8,58.95 36.51,58.95 36.28,58.72 36.28,56.68 36.59,56.37 37.19,56.37 R16.1 | v34.91,53.69 34.94,53.66 35.66,53.66 37.15,55.15 R16.1 | 37.06,56.37 R16.1
USART6_RX  (via drill 0.6)
  Top 0.2: U1.38 36.23,60.93 v36.8,61.5
  Bottom 0.2: v36.8,61.5 43.5,61.5 44.8,62.8 47.1,62.8 49.8,60.1 66.38,60.1 66.9,59.58 U$2.14
USART6_TX  (via drill 0.6)
  Top 0.2: U1.37 36.73,60.13 v37,60.4
  Bottom 0.2: U$2.13 62.6,58.6 62.2,58.6 61.3,59.5 49.5,59.5 46.7,62.3 45.1,62.3 43.8,61 37.8,61 37.2,60.4 v37,60.4
USBDM
  Top 0.2: U1.44 33.23,57.07 32.6,57.7 32.6,58.9 32.4,59.1 30.9,59.1 30.4,59.6 29.23,59.6 R3.1
USBDP
  Top 0.2: U1.45 32.73,56.97 32.4,57.3 32.2,57.3 31.9,57.6 31.9,57.94 R2.1 31.14,58.4 31.9,58.4
USBVBUS  (via drill 0.6)
  Top 0.406: v57.6,64.3 62.2,64.3 69.55,71.65 74.72,71.65 POWER.3
  Bottom 0.2: C18.1 54.35,65.25
  Bottom 0.406: v57.6,64.3 U3.1 C18.1 | v57.6,64.3 | X1.VBUS 9.46,68.06 9.8,68.4 10.4,68.4 10.9,68.9 10.9,72.3 12.4,73.8 62.8,73.8 64.6,72 75.07,72 POWER.3
VCC  (via drill 0.6)
  Top 0.2: 14.6,39.1 15.99,37.7 U8.8 20.95,37.7 C9.1 21.55,37.1 23.4,37.1 23.7,36.8 23.7,33.2 24.2,32.7 36.6,32.7 40.23,36.33 41.03,36.33 41.6,36.9 41.6,37.7 41.2,38.1 40,38.1 39.7,38.4 39.7,40.9 37.23,43.37 U1.13 | 14.6,39.1 U7.8 | C20.1 13.18,44.47 U7.5 14.79,42.91 v15.1,42.6 | v15.1,40.2 15.1,39.6 14.6,39.1
  Bottom 0.2: v15.1,42.6 v15.1,40.2
  Bottom 0.254: L8.1 17.73,37.57 v15.1,40.2

### Text on the board
tNames: + | + | STM32F4CONSOLE_1.1
bNames: GND | GND